# EAGLE design EMGrealPart5-all2 (EAGLE 9.4.0)

## Sheet 1 of 6
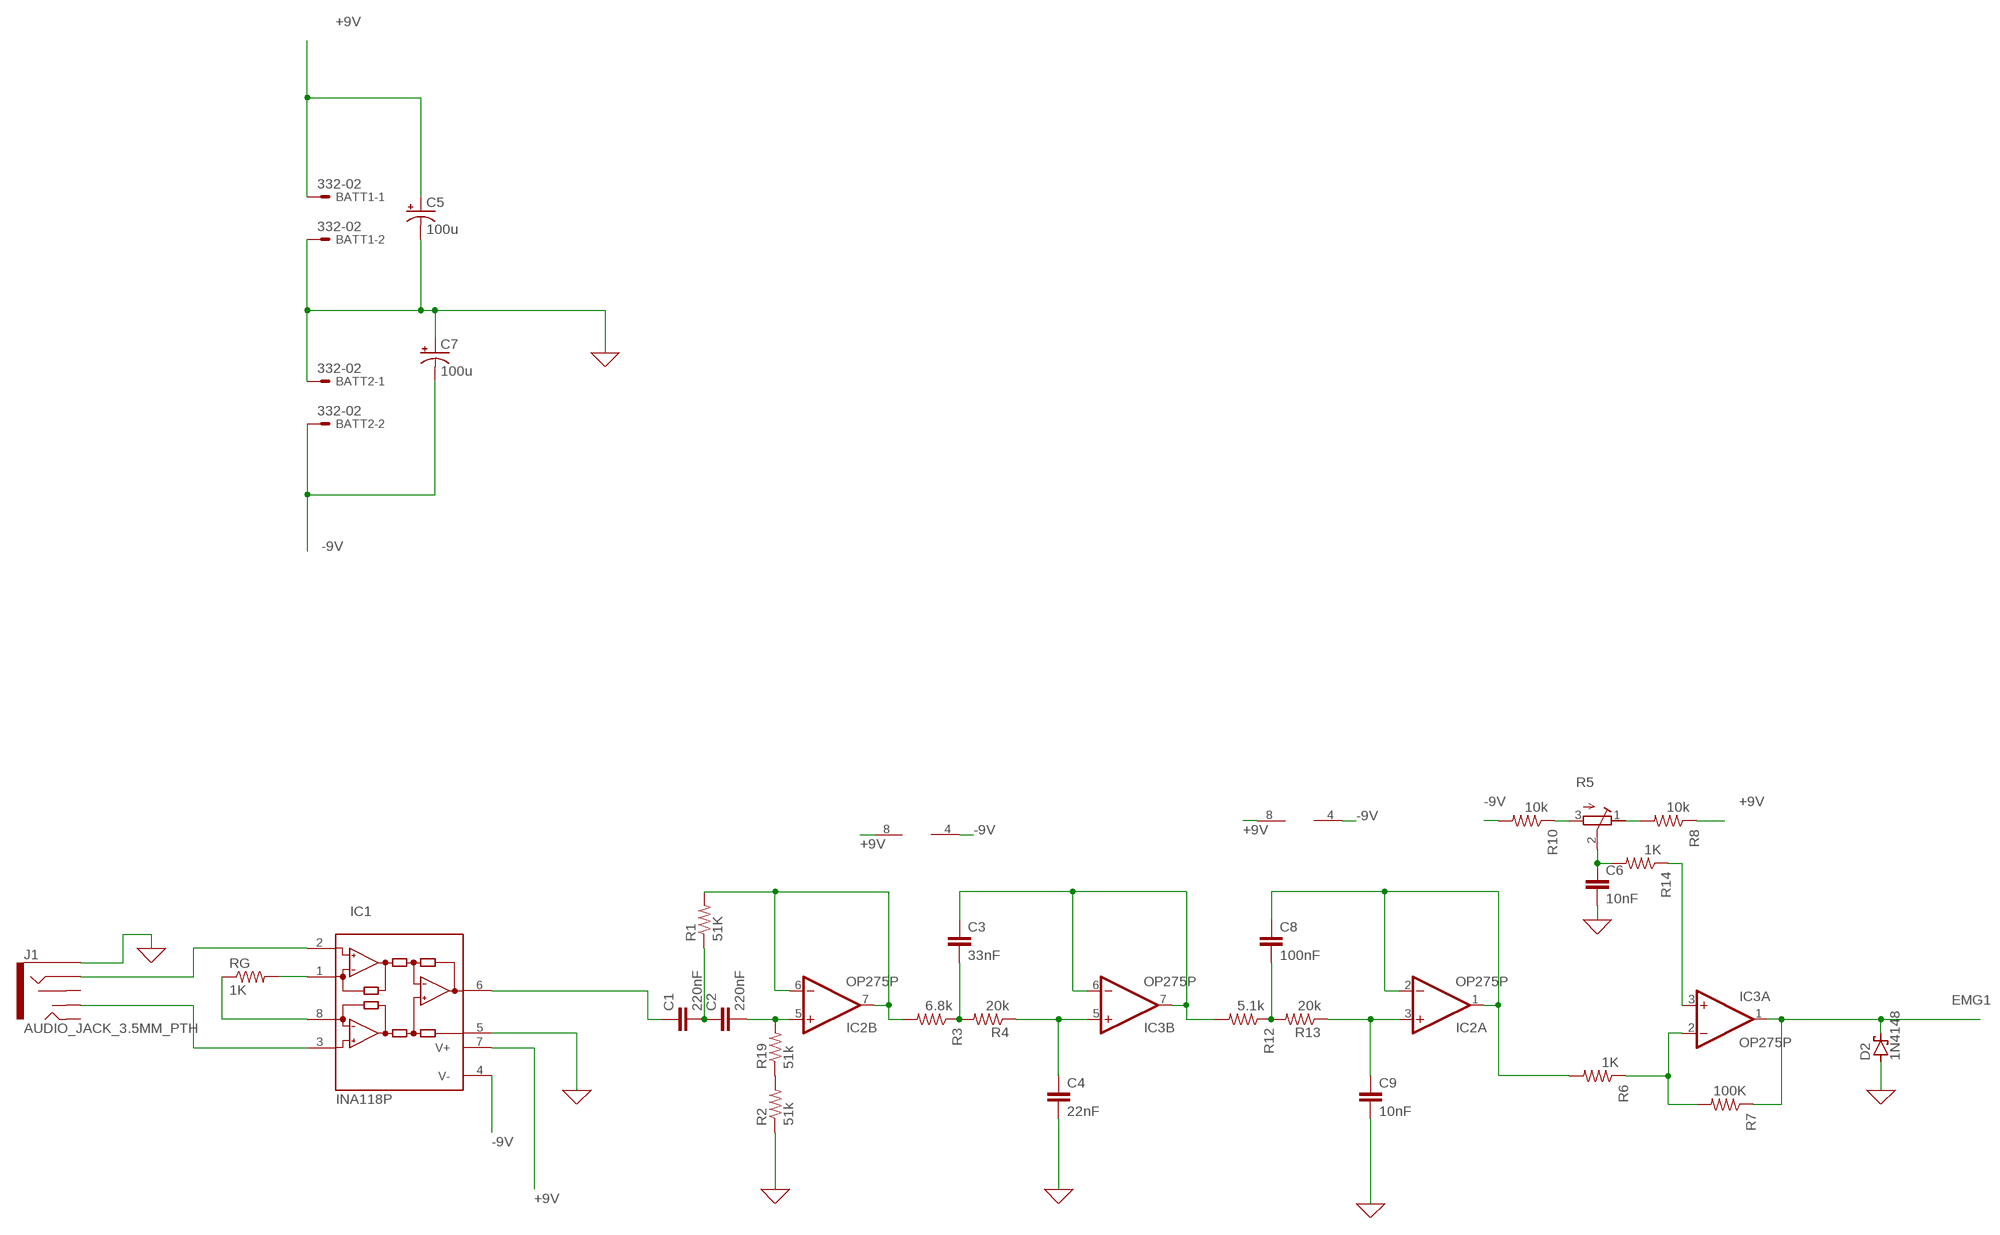
[diagram p0: schematic, sheet 1]

### Parts
BATT1  332-02  [332-02]
BATT2  332-02  [332-02]
C1  220nF  C-EU050-025X075  [C050-025X075]
C2  220nF  C-EU050-025X075  [C050-025X075]
C3  33nF  C-EU050-025X075  [C050-025X075]
C4  22nF  C-EU050-025X075  [C050-025X075]
C5  100u  CPOL-USE2.5-6  [E2,5-6]
C6  10nF  C-EU050-025X075  [C050-025X075]
C7  100u  CPOL-USE2.5-6  [E2,5-6]
C8  100nF  C-EU050-025X075  [C050-025X075]
C9  10nF  C-EU050-025X075  [C050-025X075]
D2  1N4148  SCHOTTKY-DIODEF126Z12  [F126Z12]
IC1  INA118P  [DIL08]
IC2  OP275P  [DIL08]
IC3  OP275P  [DIL08]
J1  AUDIO_JACK_3.5MM_PTH  [AUDIO-JACK]
R1  51K  R-US_0207/12  [0207/12]
R2  51k  R-US_0207/12  [0207/12]
R3  6.8k  R-US_0207/12  [0207/12]
R4  20k  R-US_0207/12  [0207/12]
R5  R-TRIMMT93YA  [RTRIMT93YA]
R6  1K  R-US_0207/12  [0207/12]
R7  100K  R-US_0207/12  [0207/12]
R8  10k  R-US_0207/12  [0207/12]
R10  10k  R-US_0207/12  [0207/12]
R12  5.1k  R-US_0207/12  [0207/12]
R13  20k  R-US_0207/12  [0207/12]
R14  1K  R-US_0207/12  [0207/12]
R19  51k  R-US_0207/12  [0207/12]
RG  1K  R-US_0207/12  [0207/12]

### Nets
0 [supply]: BATT1.2 BATT2.1 C4.2 C5.- C6.2 C7.+ C9.2 D2.A IC1.5(REF) J1.SLEEVE R2.1 ; supply symbol labelled GND ; also sheet 2,3,4,5
+9V [supply]: BATT1.1 C5.+ IC1.7(V+) IC2.8(P:V+) IC3.8(P:V+) R8.1 ; also sheet 2,3,4
-9V [supply]: BATT2.2 C7.- IC1.4(V-) IC2.4(P:V-) IC3.4(P:V-) R10.2 ; also sheet 2,3,4
EMG1 [signal]: D2.C IC3.1(A:OUT) R7.1 ; also sheet 5
N$1 [signal]: IC1.1(RG) RG.2
N$2 [signal]: IC1.8(RG) RG.1
N$3 [signal]: IC1.2(-IN) J1.RING
N$4 [signal]: C8.2 R12.1 R13.2
N$5 [signal]: C1.2 C2.1 R1.1
N$6 [signal]: C1.1 IC1.6(OUT)
N$7 [signal]: C2.2 IC2.5(B:+IN) R19.2
N$8 [signal]: IC2.6(B:-IN) IC2.7(B:OUT) R1.2 R3.2
N$9 [signal]: C3.2 R3.1 R4.2
N$10 [signal]: C4.1 IC3.5(B:+IN) R4.1
N$11 [signal]: C3.1 IC3.6(B:-IN) IC3.7(B:OUT) R12.2
N$14 [signal]: C9.1 IC2.3(A:+IN) R13.1
N$15 [signal]: R5.3(A) R10.1
N$16 [signal]: C6.1 R5.2(S) R14.2
N$17 [signal]: IC3.2(A:-IN) R6.1 R7.2
N$18 [signal]: R2.2 R19.1
N$19 [signal]: C8.1 IC2.1(A:OUT) IC2.2(A:-IN) R6.2
N$20 [signal]: R5.1(E) R8.2
N$25 [signal]: IC3.3(A:+IN) R14.1
N$26 [signal]: IC1.3(+IN) J1.TSH
Unconnected: J1.RSH J1.TIP

## Sheet 2 of 6
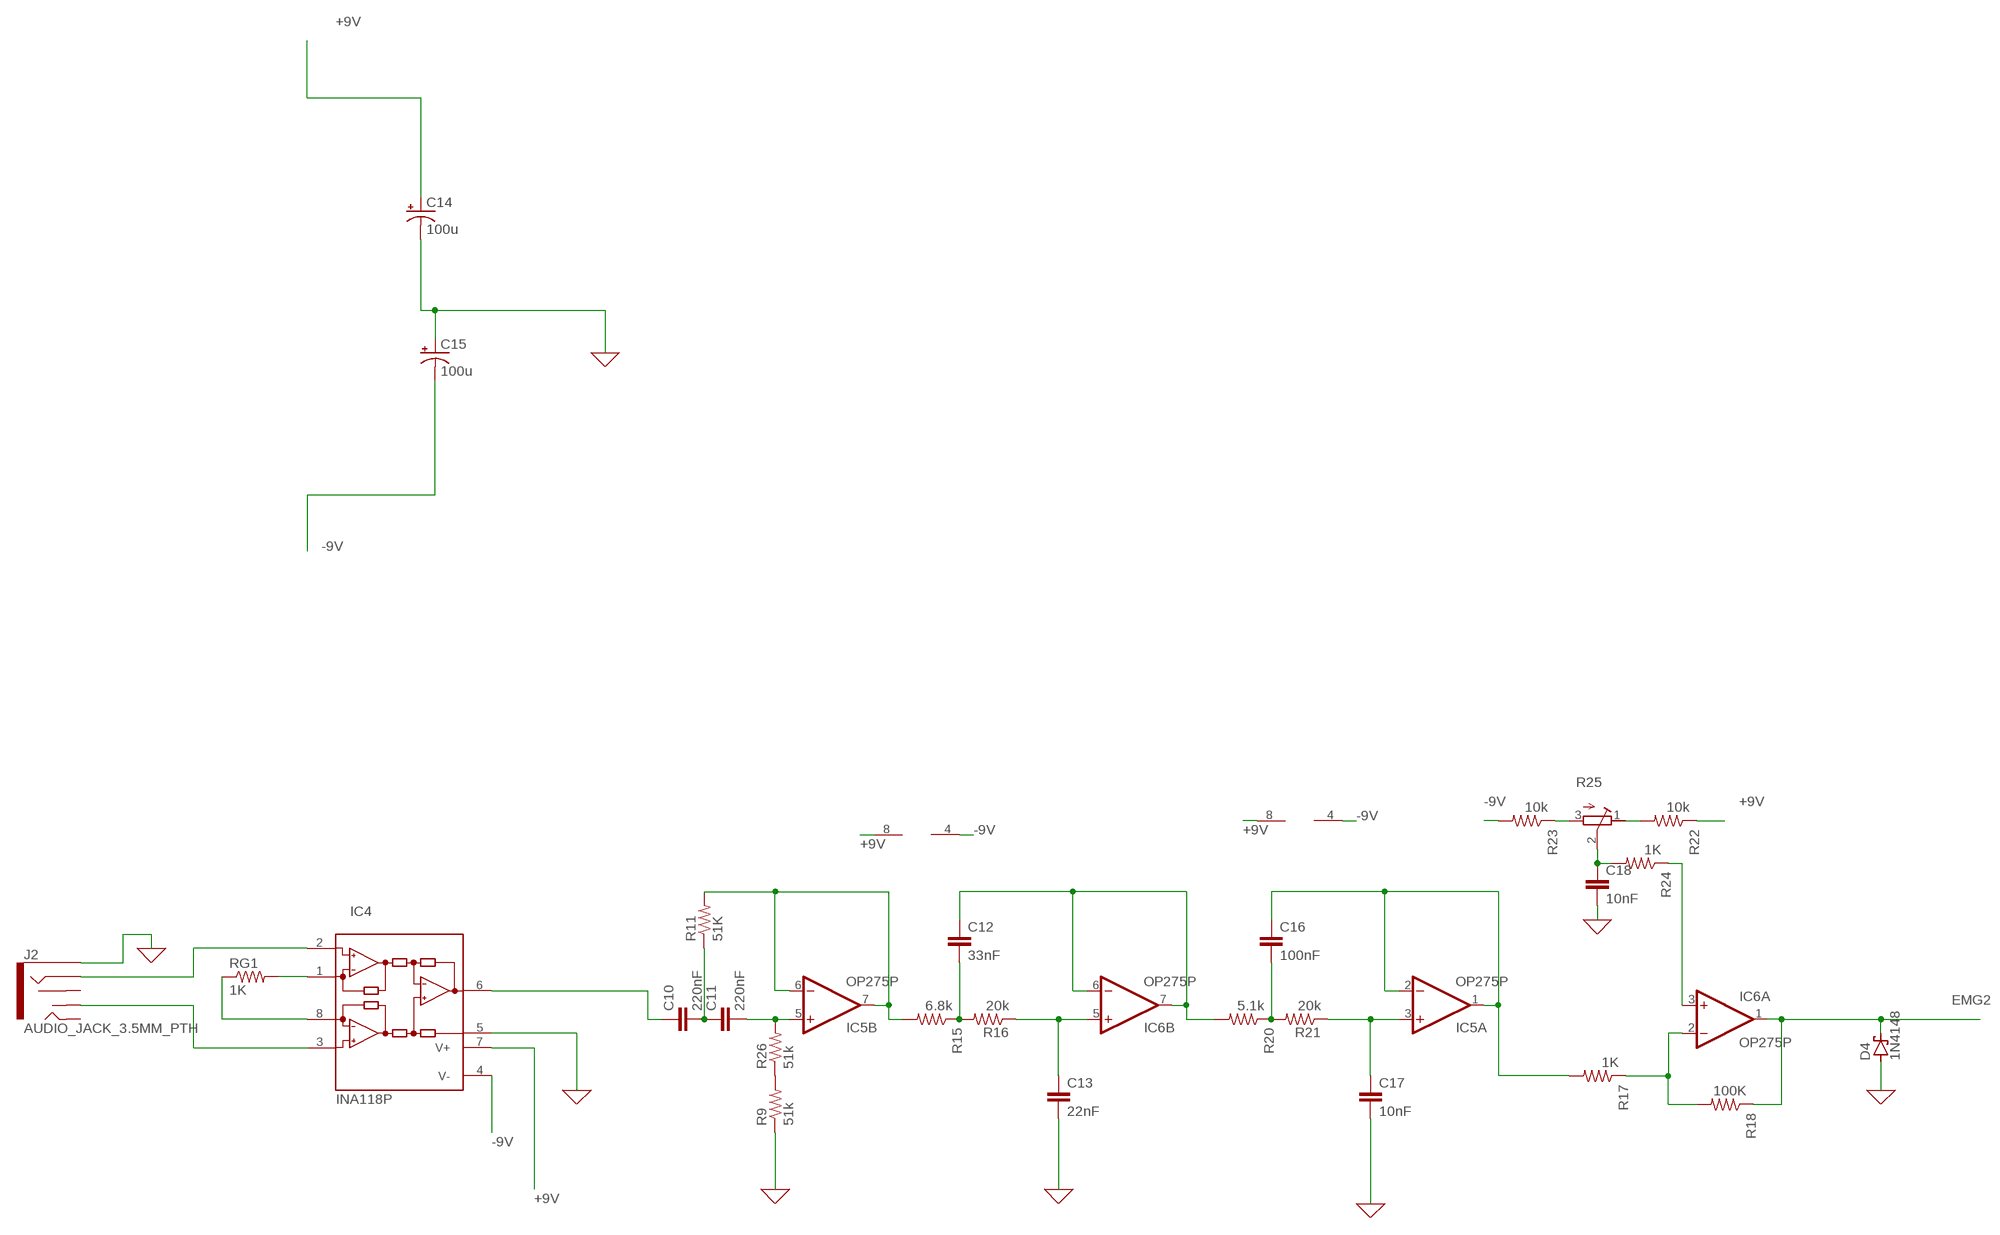
[diagram p1: schematic, sheet 2]

### Parts
C10  220nF  C-EU050-025X075  [C050-025X075]
C11  220nF  C-EU050-025X075  [C050-025X075]
C12  33nF  C-EU050-025X075  [C050-025X075]
C13  22nF  C-EU050-025X075  [C050-025X075]
C14  100u  CPOL-USE2.5-6  [E2,5-6]
C15  100u  CPOL-USE2.5-6  [E2,5-6]
C16  100nF  C-EU050-025X075  [C050-025X075]
C17  10nF  C-EU050-025X075  [C050-025X075]
C18  10nF  C-EU050-025X075  [C050-025X075]
D4  1N4148  SCHOTTKY-DIODEF126Z12  [F126Z12]
IC4  INA118P  [DIL08]
IC5  OP275P  [DIL08]
IC6  OP275P  [DIL08]
J2  AUDIO_JACK_3.5MM_PTH  [AUDIO-JACK]
R9  51k  R-US_0207/12  [0207/12]
R11  51K  R-US_0207/12  [0207/12]
R15  6.8k  R-US_0207/12  [0207/12]
R16  20k  R-US_0207/12  [0207/12]
R17  1K  R-US_0207/12  [0207/12]
R18  100K  R-US_0207/12  [0207/12]
R20  5.1k  R-US_0207/12  [0207/12]
R21  20k  R-US_0207/12  [0207/12]
R22  10k  R-US_0207/12  [0207/12]
R23  10k  R-US_0207/12  [0207/12]
R24  1K  R-US_0207/12  [0207/12]
R25  R-TRIMMT93YA  [RTRIMT93YA]
R26  51k  R-US_0207/12  [0207/12]
RG1  1K  R-US_0207/12  [0207/12]

### Nets
0 [supply]: C13.2 C14.- C15.+ C17.2 C18.2 D4.A IC4.5(REF) J2.SLEEVE R9.1 ; supply symbol labelled GND ; also sheet 1,3,4,5
+9V [supply]: C14.+ IC4.7(V+) IC5.8(P:V+) IC6.8(P:V+) R22.1 ; also sheet 1,3,4
-9V [supply]: C15.- IC4.4(V-) IC5.4(P:V-) IC6.4(P:V-) R23.2 ; also sheet 1,3,4
EMG2 [signal]: D4.C IC6.1(A:OUT) R18.1 ; also sheet 5
N$21 [signal]: IC4.1(RG) RG1.2
N$22 [signal]: IC4.8(RG) RG1.1
N$23 [signal]: C10.1 IC4.6(OUT)
N$24 [signal]: C10.2 C11.1 R11.1
N$27 [signal]: C11.2 IC5.5(B:+IN) R26.2
N$28 [signal]: IC5.6(B:-IN) IC5.7(B:OUT) R11.2 R15.2
N$29 [signal]: C12.2 R15.1 R16.2
N$30 [signal]: C13.1 IC6.5(B:+IN) R16.1
N$31 [signal]: C12.1 IC6.6(B:-IN) IC6.7(B:OUT) R20.2
N$32 [signal]: IC6.2(A:-IN) R17.1 R18.2
N$34 [signal]: C16.2 R20.1 R21.2
N$35 [signal]: C17.1 IC5.3(A:+IN) R21.1
N$36 [signal]: IC4.2(-IN) J2.RING
N$37 [signal]: C16.1 IC5.1(A:OUT) IC5.2(A:-IN) R17.2
N$38 [signal]: IC4.3(+IN) J2.TSH
N$39 [signal]: R23.1 R25.3(A)
N$40 [signal]: R22.2 R25.1(E)
N$41 [signal]: IC6.3(A:+IN) R24.1
N$42 [signal]: C18.1 R24.2 R25.2(S)
N$43 [signal]: R9.2 R26.1
Unconnected: J2.RSH J2.TIP

## Sheet 3 of 6
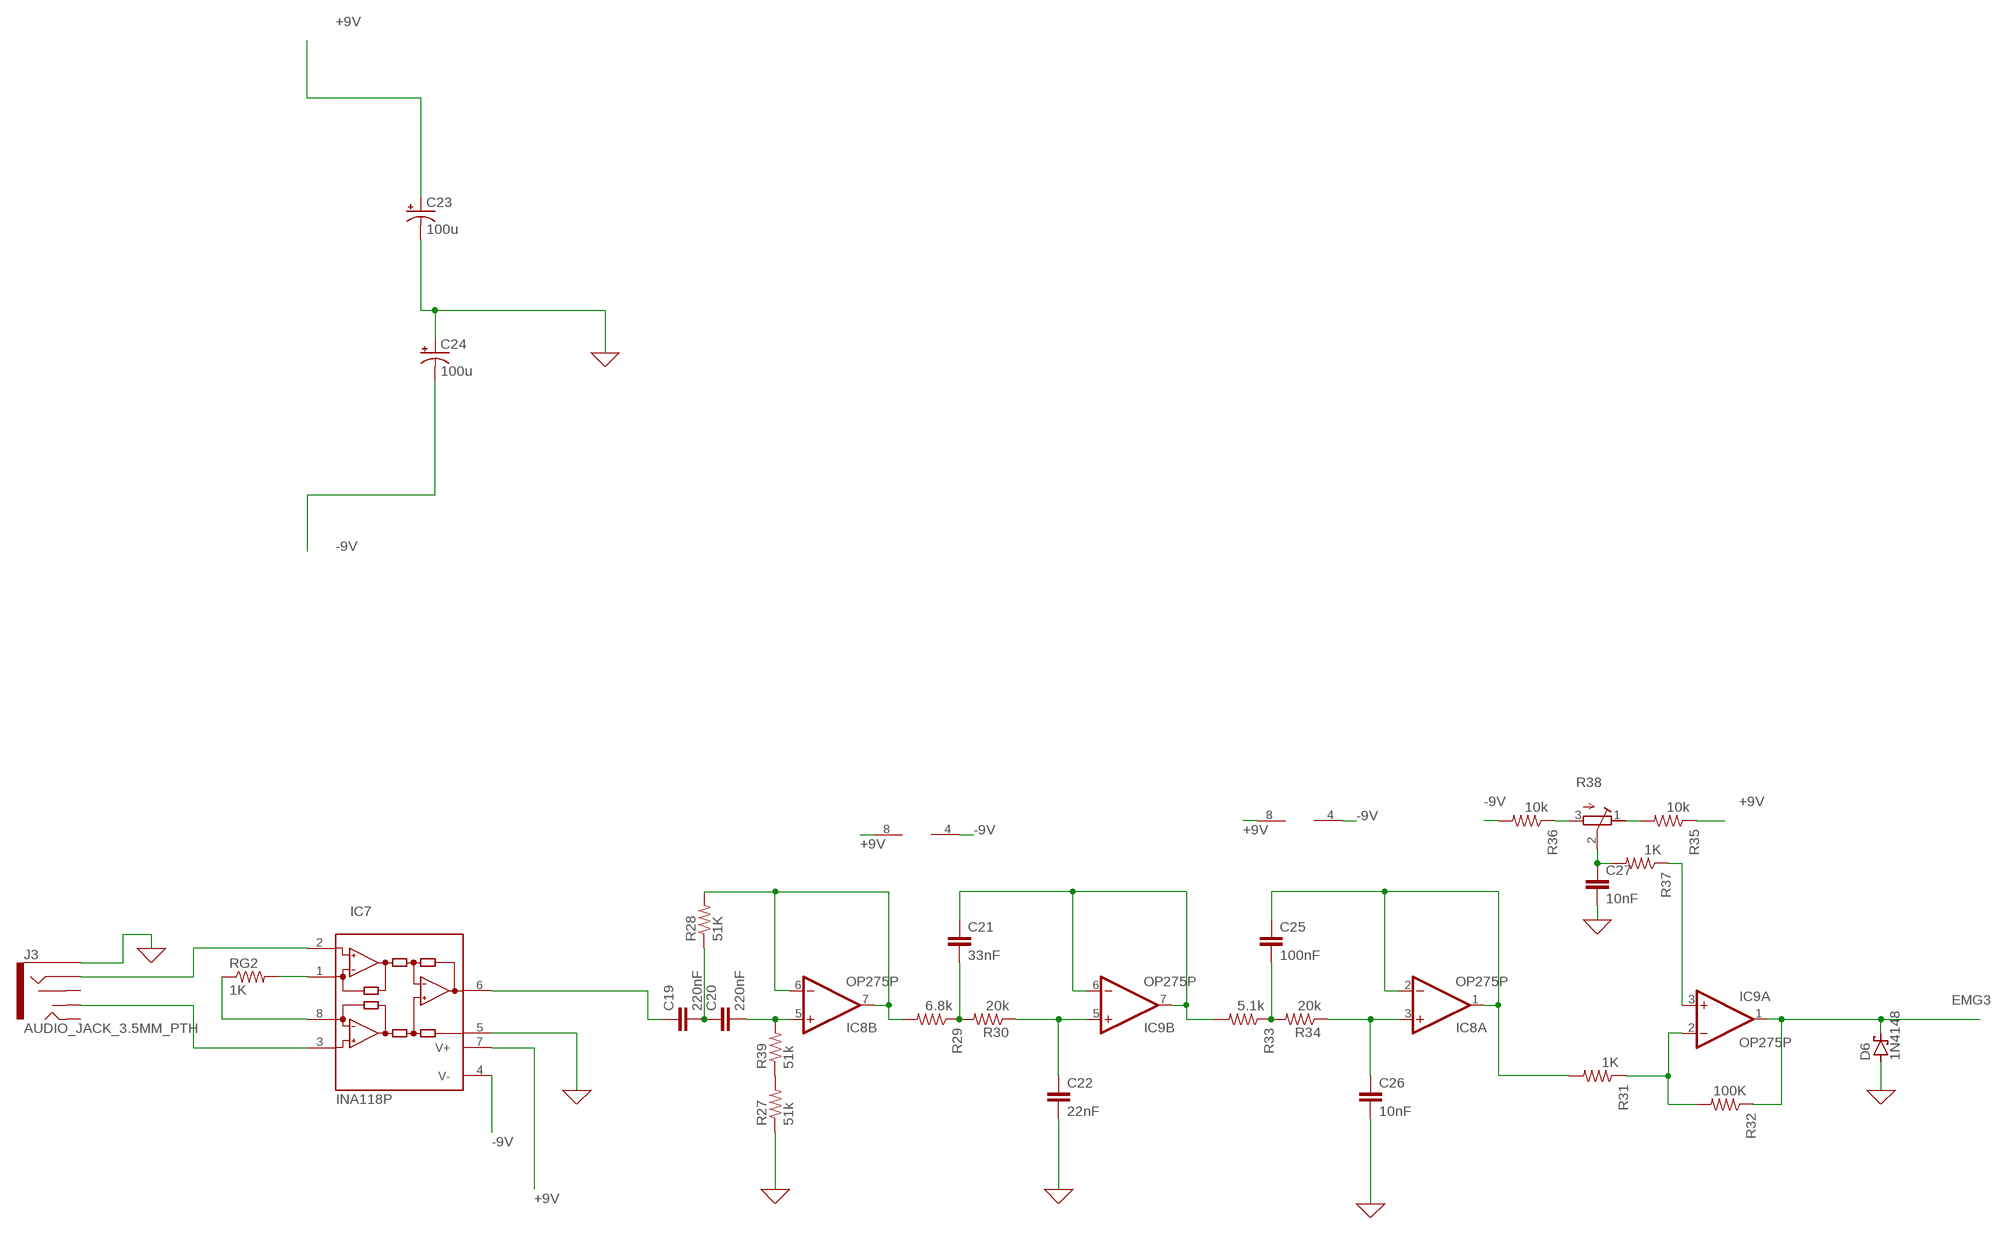
[diagram p2: schematic, sheet 3]

### Parts
C19  220nF  C-EU050-025X075  [C050-025X075]
C20  220nF  C-EU050-025X075  [C050-025X075]
C21  33nF  C-EU050-025X075  [C050-025X075]
C22  22nF  C-EU050-025X075  [C050-025X075]
C23  100u  CPOL-USE2.5-6  [E2,5-6]
C24  100u  CPOL-USE2.5-6  [E2,5-6]
C25  100nF  C-EU050-025X075  [C050-025X075]
C26  10nF  C-EU050-025X075  [C050-025X075]
C27  10nF  C-EU050-025X075  [C050-025X075]
D6  1N4148  SCHOTTKY-DIODEF126Z12  [F126Z12]
IC7  INA118P  [DIL08]
IC8  OP275P  [DIL08]
IC9  OP275P  [DIL08]
J3  AUDIO_JACK_3.5MM_PTH  [AUDIO-JACK]
R27  51k  R-US_0207/12  [0207/12]
R28  51K  R-US_0207/12  [0207/12]
R29  6.8k  R-US_0207/12  [0207/12]
R30  20k  R-US_0207/12  [0207/12]
R31  1K  R-US_0207/12  [0207/12]
R32  100K  R-US_0207/12  [0207/12]
R33  5.1k  R-US_0207/12  [0207/12]
R34  20k  R-US_0207/12  [0207/12]
R35  10k  R-US_0207/12  [0207/12]
R36  10k  R-US_0207/12  [0207/12]
R37  1K  R-US_0207/12  [0207/12]
R38  R-TRIMMT93YA  [RTRIMT93YA]
R39  51k  R-US_0207/12  [0207/12]
RG2  1K  R-US_0207/12  [0207/12]

### Nets
0 [supply]: C22.2 C23.- C24.+ C26.2 C27.2 D6.A IC7.5(REF) J3.SLEEVE R27.1 ; supply symbol labelled GND ; also sheet 1,2,4,5
+9V [supply]: C23.+ IC7.7(V+) IC8.8(P:V+) IC9.8(P:V+) R35.1 ; also sheet 1,2,4
-9V [supply]: C24.- IC7.4(V-) IC8.4(P:V-) IC9.4(P:V-) R36.2 ; also sheet 1,2,4
EMG3 [signal]: D6.C IC9.1(A:OUT) R32.1 ; also sheet 5
N$44 [signal]: IC7.1(RG) RG2.2
N$45 [signal]: IC7.8(RG) RG2.1
N$46 [signal]: C19.1 IC7.6(OUT)
N$47 [signal]: C19.2 C20.1 R28.1
N$48 [signal]: C20.2 IC8.5(B:+IN) R39.2
N$49 [signal]: IC8.6(B:-IN) IC8.7(B:OUT) R28.2 R29.2
N$50 [signal]: C21.2 R29.1 R30.2
N$51 [signal]: C22.1 IC9.5(B:+IN) R30.1
N$52 [signal]: C21.1 IC9.6(B:-IN) IC9.7(B:OUT) R33.2
N$53 [signal]: IC9.2(A:-IN) R31.1 R32.2
N$55 [signal]: C25.2 R33.1 R34.2
N$56 [signal]: C26.1 IC8.3(A:+IN) R34.1
N$57 [signal]: IC7.2(-IN) J3.RING
N$58 [signal]: C25.1 IC8.1(A:OUT) IC8.2(A:-IN) R31.2
N$59 [signal]: IC7.3(+IN) J3.TSH
N$60 [signal]: R36.1 R38.3(A)
N$61 [signal]: R35.2 R38.1(E)
N$62 [signal]: IC9.3(A:+IN) R37.1
N$63 [signal]: C27.1 R37.2 R38.2(S)
N$64 [signal]: R27.2 R39.1
Unconnected: J3.RSH J3.TIP

## Sheet 4 of 6
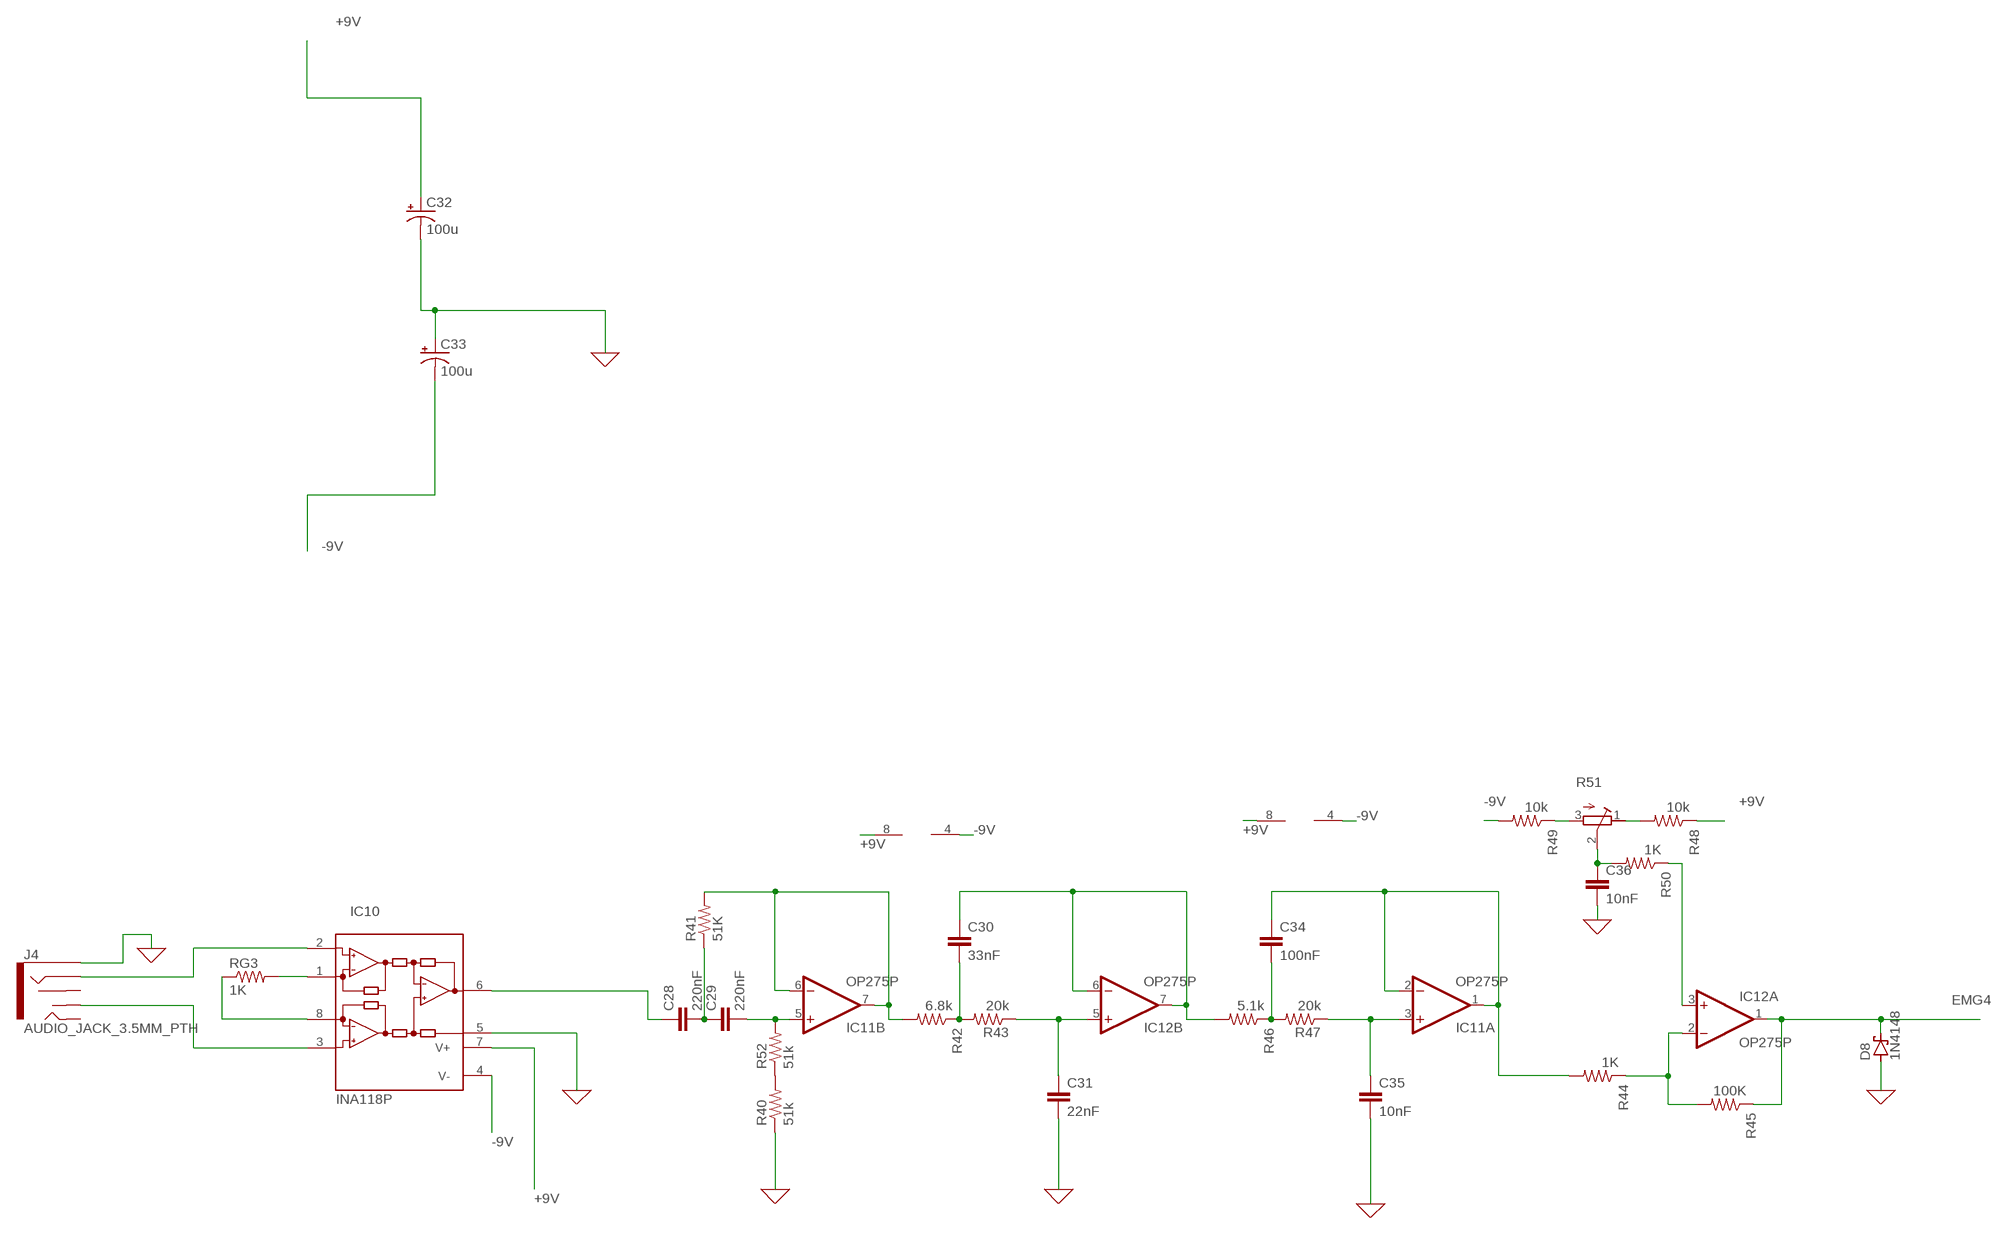
[diagram p3: schematic, sheet 4]

### Parts
C28  220nF  C-EU050-025X075  [C050-025X075]
C29  220nF  C-EU050-025X075  [C050-025X075]
C30  33nF  C-EU050-025X075  [C050-025X075]
C31  22nF  C-EU050-025X075  [C050-025X075]
C32  100u  CPOL-USE2.5-6  [E2,5-6]
C33  100u  CPOL-USE2.5-6  [E2,5-6]
C34  100nF  C-EU050-025X075  [C050-025X075]
C35  10nF  C-EU050-025X075  [C050-025X075]
C36  10nF  C-EU050-025X075  [C050-025X075]
D8  1N4148  SCHOTTKY-DIODEF126Z12  [F126Z12]
IC10  INA118P  [DIL08]
IC11  OP275P  [DIL08]
IC12  OP275P  [DIL08]
J4  AUDIO_JACK_3.5MM_PTH  [AUDIO-JACK]
R40  51k  R-US_0207/12  [0207/12]
R41  51K  R-US_0207/12  [0207/12]
R42  6.8k  R-US_0207/12  [0207/12]
R43  20k  R-US_0207/12  [0207/12]
R44  1K  R-US_0207/12  [0207/12]
R45  100K  R-US_0207/12  [0207/12]
R46  5.1k  R-US_0207/12  [0207/12]
R47  20k  R-US_0207/12  [0207/12]
R48  10k  R-US_0207/12  [0207/12]
R49  10k  R-US_0207/12  [0207/12]
R50  1K  R-US_0207/12  [0207/12]
R51  R-TRIMMT93YA  [RTRIMT93YA]
R52  51k  R-US_0207/12  [0207/12]
RG3  1K  R-US_0207/12  [0207/12]

### Nets
0 [supply]: C31.2 C32.- C33.+ C35.2 C36.2 D8.A IC10.5(REF) J4.SLEEVE R40.1 ; supply symbol labelled GND ; also sheet 1,2,3,5
+9V [supply]: C32.+ IC10.7(V+) IC11.8(P:V+) IC12.8(P:V+) R48.1 ; also sheet 1,2,3
-9V [supply]: C33.- IC10.4(V-) IC11.4(P:V-) IC12.4(P:V-) R49.2 ; also sheet 1,2,3
EMG4 [signal]: D8.C IC12.1(A:OUT) R45.1 ; also sheet 5
N$65 [signal]: IC10.1(RG) RG3.2
N$66 [signal]: IC10.8(RG) RG3.1
N$67 [signal]: C28.1 IC10.6(OUT)
N$68 [signal]: C28.2 C29.1 R41.1
N$69 [signal]: C29.2 IC11.5(B:+IN) R52.2
N$70 [signal]: IC11.6(B:-IN) IC11.7(B:OUT) R41.2 R42.2
N$71 [signal]: C30.2 R42.1 R43.2
N$72 [signal]: C31.1 IC12.5(B:+IN) R43.1
N$73 [signal]: C30.1 IC12.6(B:-IN) IC12.7(B:OUT) R46.2
N$74 [signal]: IC12.2(A:-IN) R44.1 R45.2
N$76 [signal]: C34.2 R46.1 R47.2
N$77 [signal]: C35.1 IC11.3(A:+IN) R47.1
N$78 [signal]: IC10.2(-IN) J4.RING
N$79 [signal]: C34.1 IC11.1(A:OUT) IC11.2(A:-IN) R44.2
N$80 [signal]: IC10.3(+IN) J4.TSH
N$81 [signal]: R49.1 R51.3(A)
N$82 [signal]: R48.2 R51.1(E)
N$83 [signal]: IC12.3(A:+IN) R50.1
N$84 [signal]: C36.1 R50.2 R51.2(S)
N$85 [signal]: R40.2 R52.1
Unconnected: J4.RSH J4.TIP

## Sheet 5 of 6
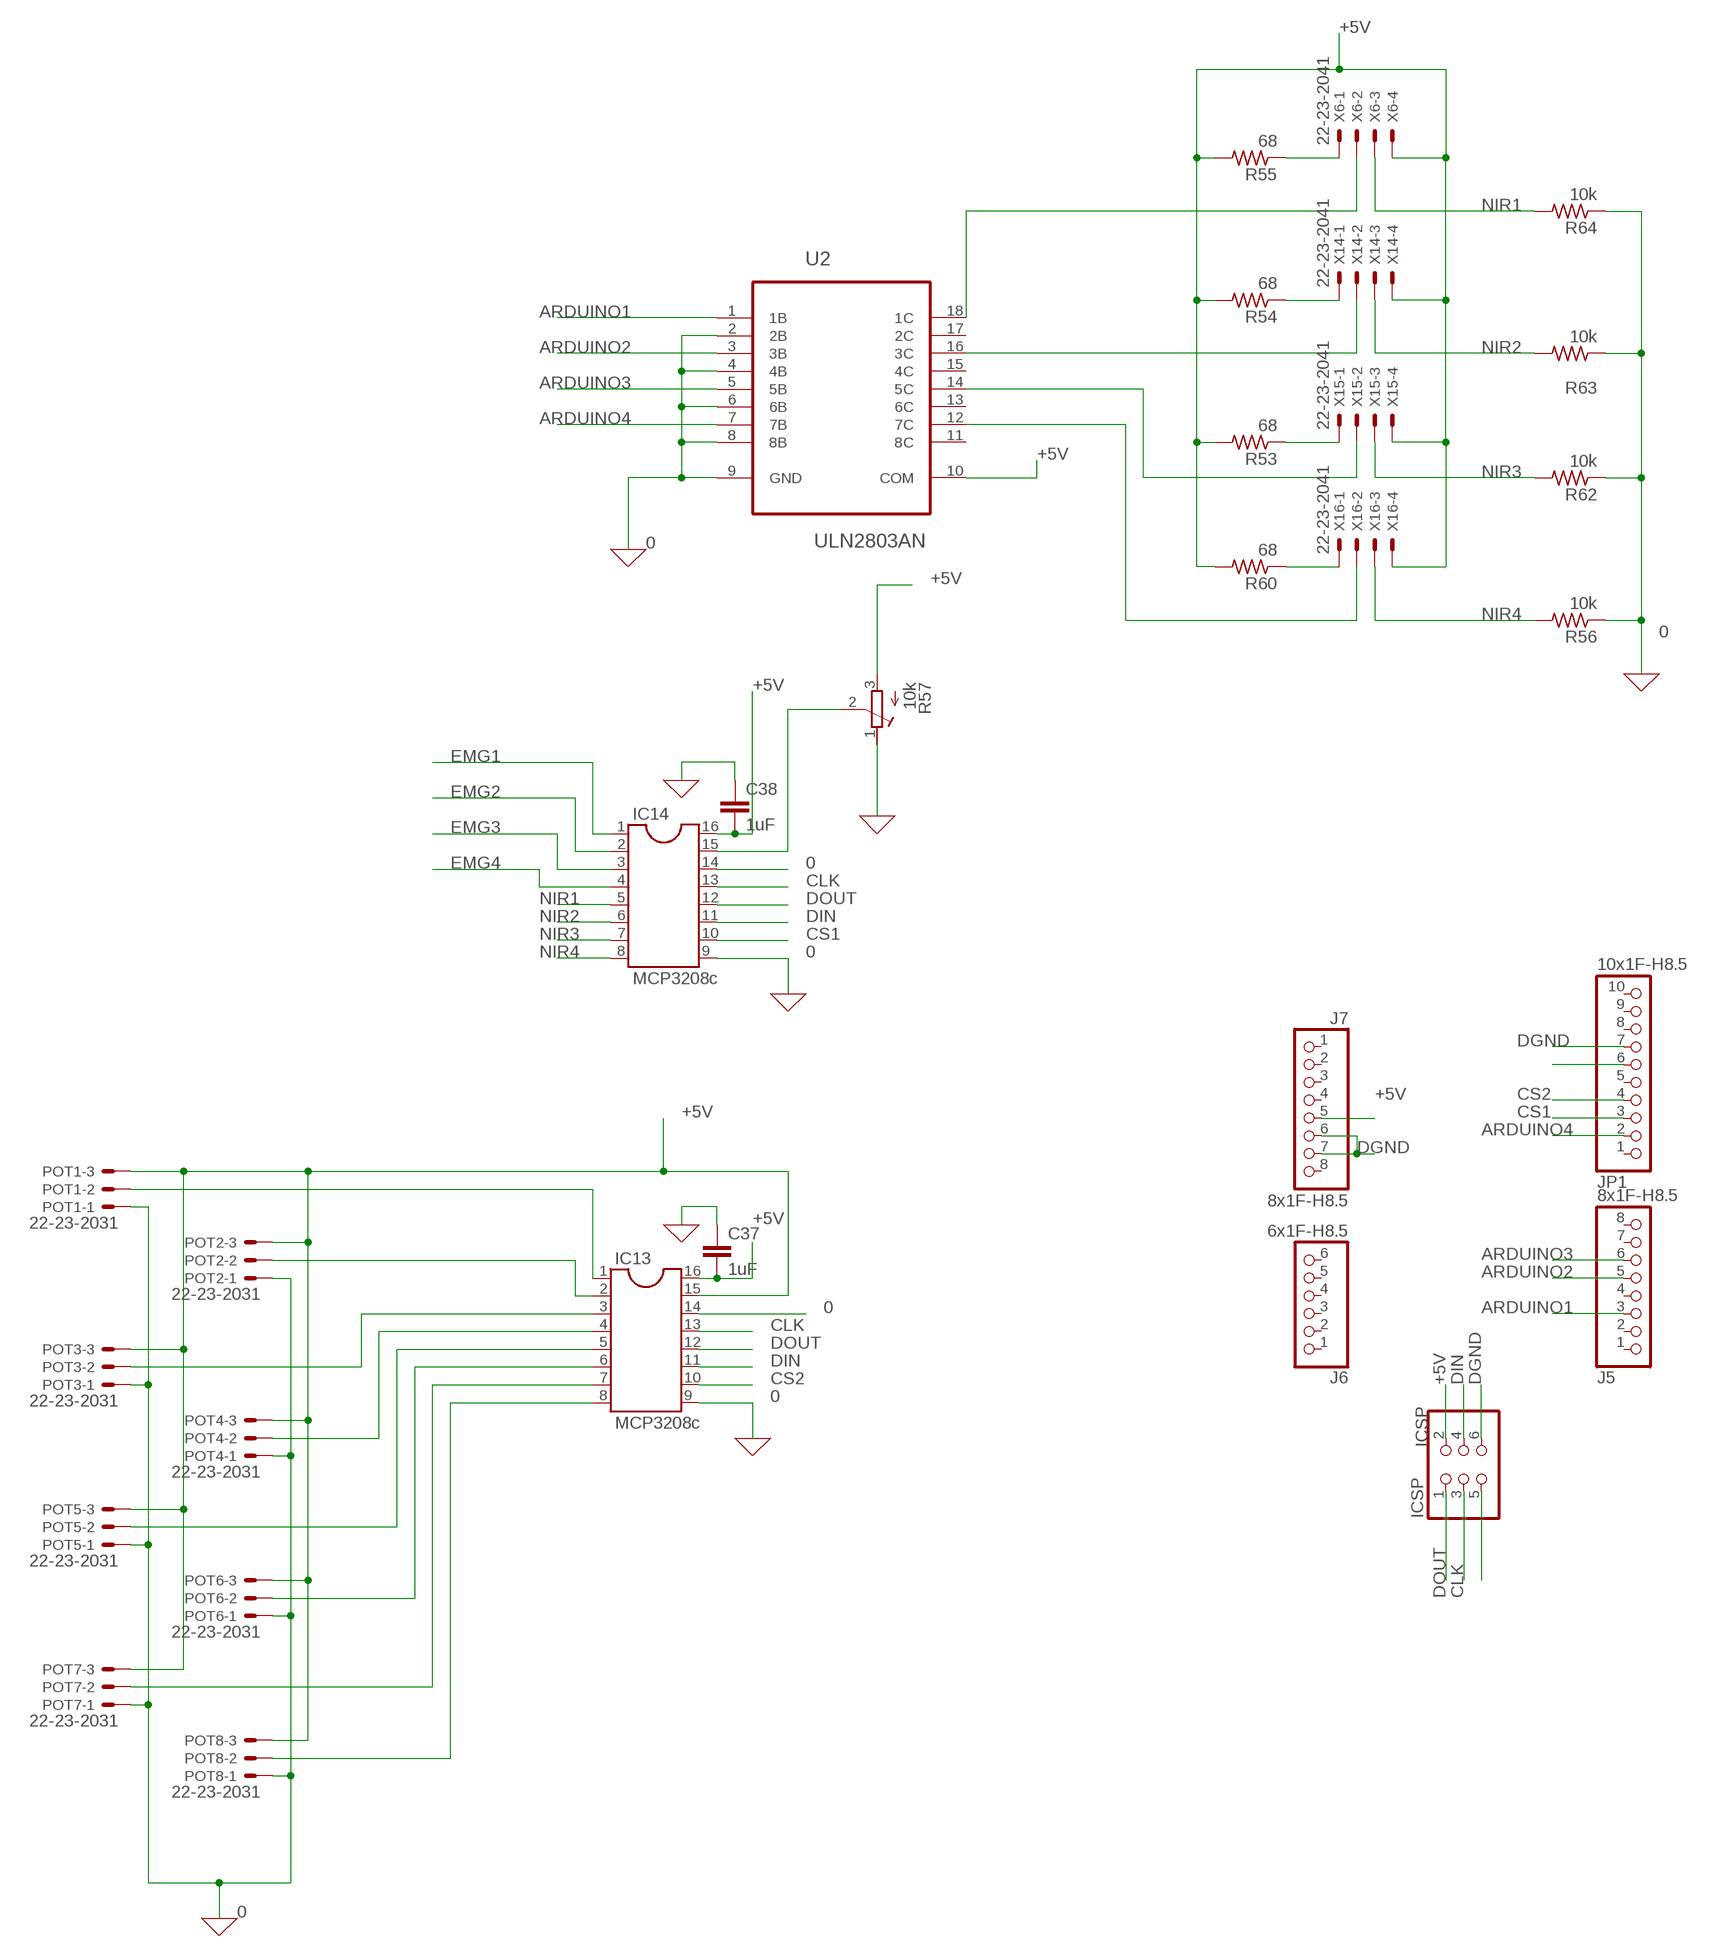
[diagram p4: schematic, sheet 5]

### Parts
C37  1uF  C-EU050-025X075  [C050-025X075]
C38  1uF  C-EU050-025X075  [C050-025X075]
IC13  MCP3208c  DIL16  [DIL16]
IC14  MCP3208c  DIL16  [DIL16]
ICSP  ICSP  PINHD-2X3  [2X03]
J5  8x1F-H8.5  PINHD-1X8  [1X08]
J6  6x1F-H8.5  PINHD-1X6  [1X06]
J7  8x1F-H8.5  PINHD-1X8  [1X08]
JP1  10x1F-H8.5  PINHD-1X10  [1X10]
POT1  22-23-2031  [22-23-2031]
POT2  22-23-2031  [22-23-2031]
POT3  22-23-2031  [22-23-2031]
POT4  22-23-2031  [22-23-2031]
POT5  22-23-2031  [22-23-2031]
POT6  22-23-2031  [22-23-2031]
POT7  22-23-2031  [22-23-2031]
POT8  22-23-2031  [22-23-2031]
R53  68  R-US_0207/12  [0207/12]
R54  68  R-US_0207/12  [0207/12]
R55  68  R-US_0207/12  [0207/12]
R56  10k  R-US_0207/12  [0207/12]
R57  10k  R-TRIMMT93YA  [RTRIMT93YA]
R60  68  R-US_0207/12  [0207/12]
R62  10k  R-US_0207/12  [0207/12]
R63  10k  R-US_0207/12  [0207/12]
R64  10k  R-US_0207/12  [0207/12]
U2  ULN2803AN  [DIP254P762X393-18]
X6  22-23-2041  [22-23-2041]
X14  22-23-2041  [22-23-2041]
X15  22-23-2041  [22-23-2041]
X16  22-23-2041  [22-23-2041]

### Nets
0 [supply]: C37.1 C38.1 IC13.9 IC13.14 IC14.9 IC14.14 POT1.1 POT2.1 POT3.1 POT4.1 POT5.1 POT6.1 POT7.1 POT8.1 R56.1 R57.1(E) R62.1 R63.1 R64.1 U2.2(2B) U2.4(4B) U2.6(6B) U2.8(8B) U2.9(GND) ; supply symbol labelled GND ; also sheet 1,2,3,4
+5V [supply]: C37.2 C38.2 IC13.15 IC13.16 IC14.16 ICSP.2 J7.5 POT1.3 POT2.3 POT3.3 POT4.3 POT5.3 POT6.3 POT7.3 POT8.3 R53.2 R54.2 R55.2 R57.3(A) R60.2 U2.10(COM) X6.4 X14.4 X15.4 X16.4
ARDUINO1 [signal]: J5.3 U2.1(1B)
ARDUINO2 [signal]: J5.5 U2.3(3B)
ARDUINO3 [signal]: J5.6 U2.5(5B)
ARDUINO4 [signal]: JP1.2 U2.7(7B)
CLK [signal]: IC13.13 IC14.13 ICSP.3
CS1 [signal]: IC14.10 JP1.3
CS2 [signal]: IC13.10 JP1.4
DGND [supply]: ICSP.6 J7.6 J7.7 JP1.7
DIN [signal]: IC13.11 IC14.11 ICSP.4
DOUT [signal]: IC13.12 IC14.12 ICSP.1
EMG1 [signal]: IC14.1 ; also sheet 1
EMG2 [signal]: IC14.2 ; also sheet 2
EMG3 [signal]: IC14.3 ; also sheet 3
EMG4 [signal]: IC14.4 ; also sheet 4
N$12 [signal]: U2.18(1C) X6.2
N$86 [signal]: U2.16(3C) X14.2
N$87 [signal]: U2.14(5C) X15.2
N$88 [signal]: U2.12(7C) X16.2
N$89 [signal]: IC13.1 POT1.2
N$90 [signal]: IC13.2 POT2.2
N$91 [signal]: IC13.3 POT3.2
N$92 [signal]: IC13.4 POT4.2
N$93 [signal]: IC13.5 POT5.2
N$94 [signal]: IC13.6 POT6.2
N$95 [signal]: IC13.7 POT7.2
N$96 [signal]: IC13.8 POT8.2
N$97 [signal]: IC14.15 R57.2(S)
N$98 [signal]: R55.1 X6.1
N$99 [signal]: R54.1 X14.1
N$100 [signal]: R53.1 X15.1
N$101 [signal]: R60.1 X16.1
N$102: ICSP.5
N$103: JP1.6
NIR1 [signal]: IC14.5 R64.2 X6.3
NIR2 [signal]: IC14.6 R63.2 X14.3
NIR3 [signal]: IC14.7 R62.2 X15.3
NIR4 [signal]: IC14.8 R56.2 X16.3
Unconnected: J5.1 J5.2 J5.4 J5.7 J5.8 J6.1 J6.2 J6.3 J6.4 J6.5 J6.6 J7.1 J7.2 J7.3 J7.4 J7.8 JP1.1 JP1.5 JP1.8 JP1.9 JP1.10 U2.11(8C) U2.13(6C) U2.15(4C) U2.17(2C)

## Sheet 6 of 6

## Library data of the parts
BATT1 BATT2 = con-garry:332-02: 2 Pin - 2mm Dual Row Source: www.mpe-connector.de / garry_shortform_2012.pdf
C1-C4 C6 C8-C13 C16-C22 C25-C31 C34-C38 = rcl:C-EU: CAPACITOR, European symbol; SPICEPREFIX: C
C5 C7 C14 C15 C23 C24 C32 C33 = rcl:CPOL-US: POLARIZED CAPACITOR, American symbol; SPICEPREFIX: C
D2 D4 D6 D8 = diode:SCHOTTKY-DIODE: Schottky Diode
IC1 IC4 IC7 IC10 = burr-brown:INA118: Instrumentation Amplifier Precision, Low Power; MF: TEXAS INSTRUMENTS; MPN: INA118P; OC_FARNELL: 1470354; OC_NEWARK: 96K4515; SPICEMODEL: INA118a; SPICEPREFIX: X
IC2 IC3 IC5 IC6 IC8 IC9 IC11 IC12 = linear:OP275: Dual Very Low Noise Precision Operational Amplifier Source: http://www.analog.com/static/imported-files/data_sheets/OP270.pdf; SPICEMODEL: OP275p; SPICEPREFIX: X
IC13 IC14 = ic-package:DIL16: Dual In Line / Socket
ICSP = SmartPrj:PINHD-2X3: PIN HEADER
J1-J4 = SparkFun-Connectors:AUDIO_JACK_3.5MM: Audio Jack 3.5mm variants of PTH and SMT stereo audio jack with bypass switches. SparkFun Products: SparkFun SparkPunk Sound Kit <[https://www.sparkfun.com/products/11177]> - PTH MP3 Trigger <https://www.sparkfun.com/products/13720> -3.5mm SMD SparkFun PicoBoard <https://www.sparkfun.com/products/11888>- 2.5mm SMD; PROD_ID: CONN-08774; SF_ID: PRT-08032
J5 J7 = SmartPrj:PINHD-1X8: PIN HEADER
J6 = SmartPrj:PINHD-1X6: PIN HEADER
JP1 = SmartPrj:PINHD-1X10: PIN HEADER
POT1-POT8 = con-molex:22-23-2031: .100" (2.54mm) Center Header - 3 Pin; MF: MOLEX; MPN: 22-23-2031; OC_FARNELL: 1462950; OC_NEWARK: 30C0862
R1-R4 R6-R24 R26-R37 R39-R50 R52-R56 R60 R62-R64 RG RG1-RG3 = rcl:R-US_: RESISTOR, American symbol; SPICEPREFIX: R
R5 R25 R38 R51 R57 = rcl:R-TRIMM: Trimm resistor; SPICEMODEL: X; SPICEPREFIXL: POT
U2 = transistor-arrays:ULN2803AN: Darlington transistor array; MPN: ULN2803AN; OC_FARNELL: 1652422; OC_NEWARK: 21J9298; PACKAGE: DIP-18; SUPPLIER: TEXAS INSTRUMENTS
X6 X14-X16 = con-molex:22-23-2041: .100" (2.54mm) Center Header - 4 Pin; MF: MOLEX; MPN: 22-23-2041; OC_FARNELL: 1462920; OC_NEWARK: 38C0355

## Module MO
Ports: OUT(io) IN(io)

### Library data of the parts

## Net classes
1 signal: width 0.305 mm
2 supply: width 0.635 mm

## Board
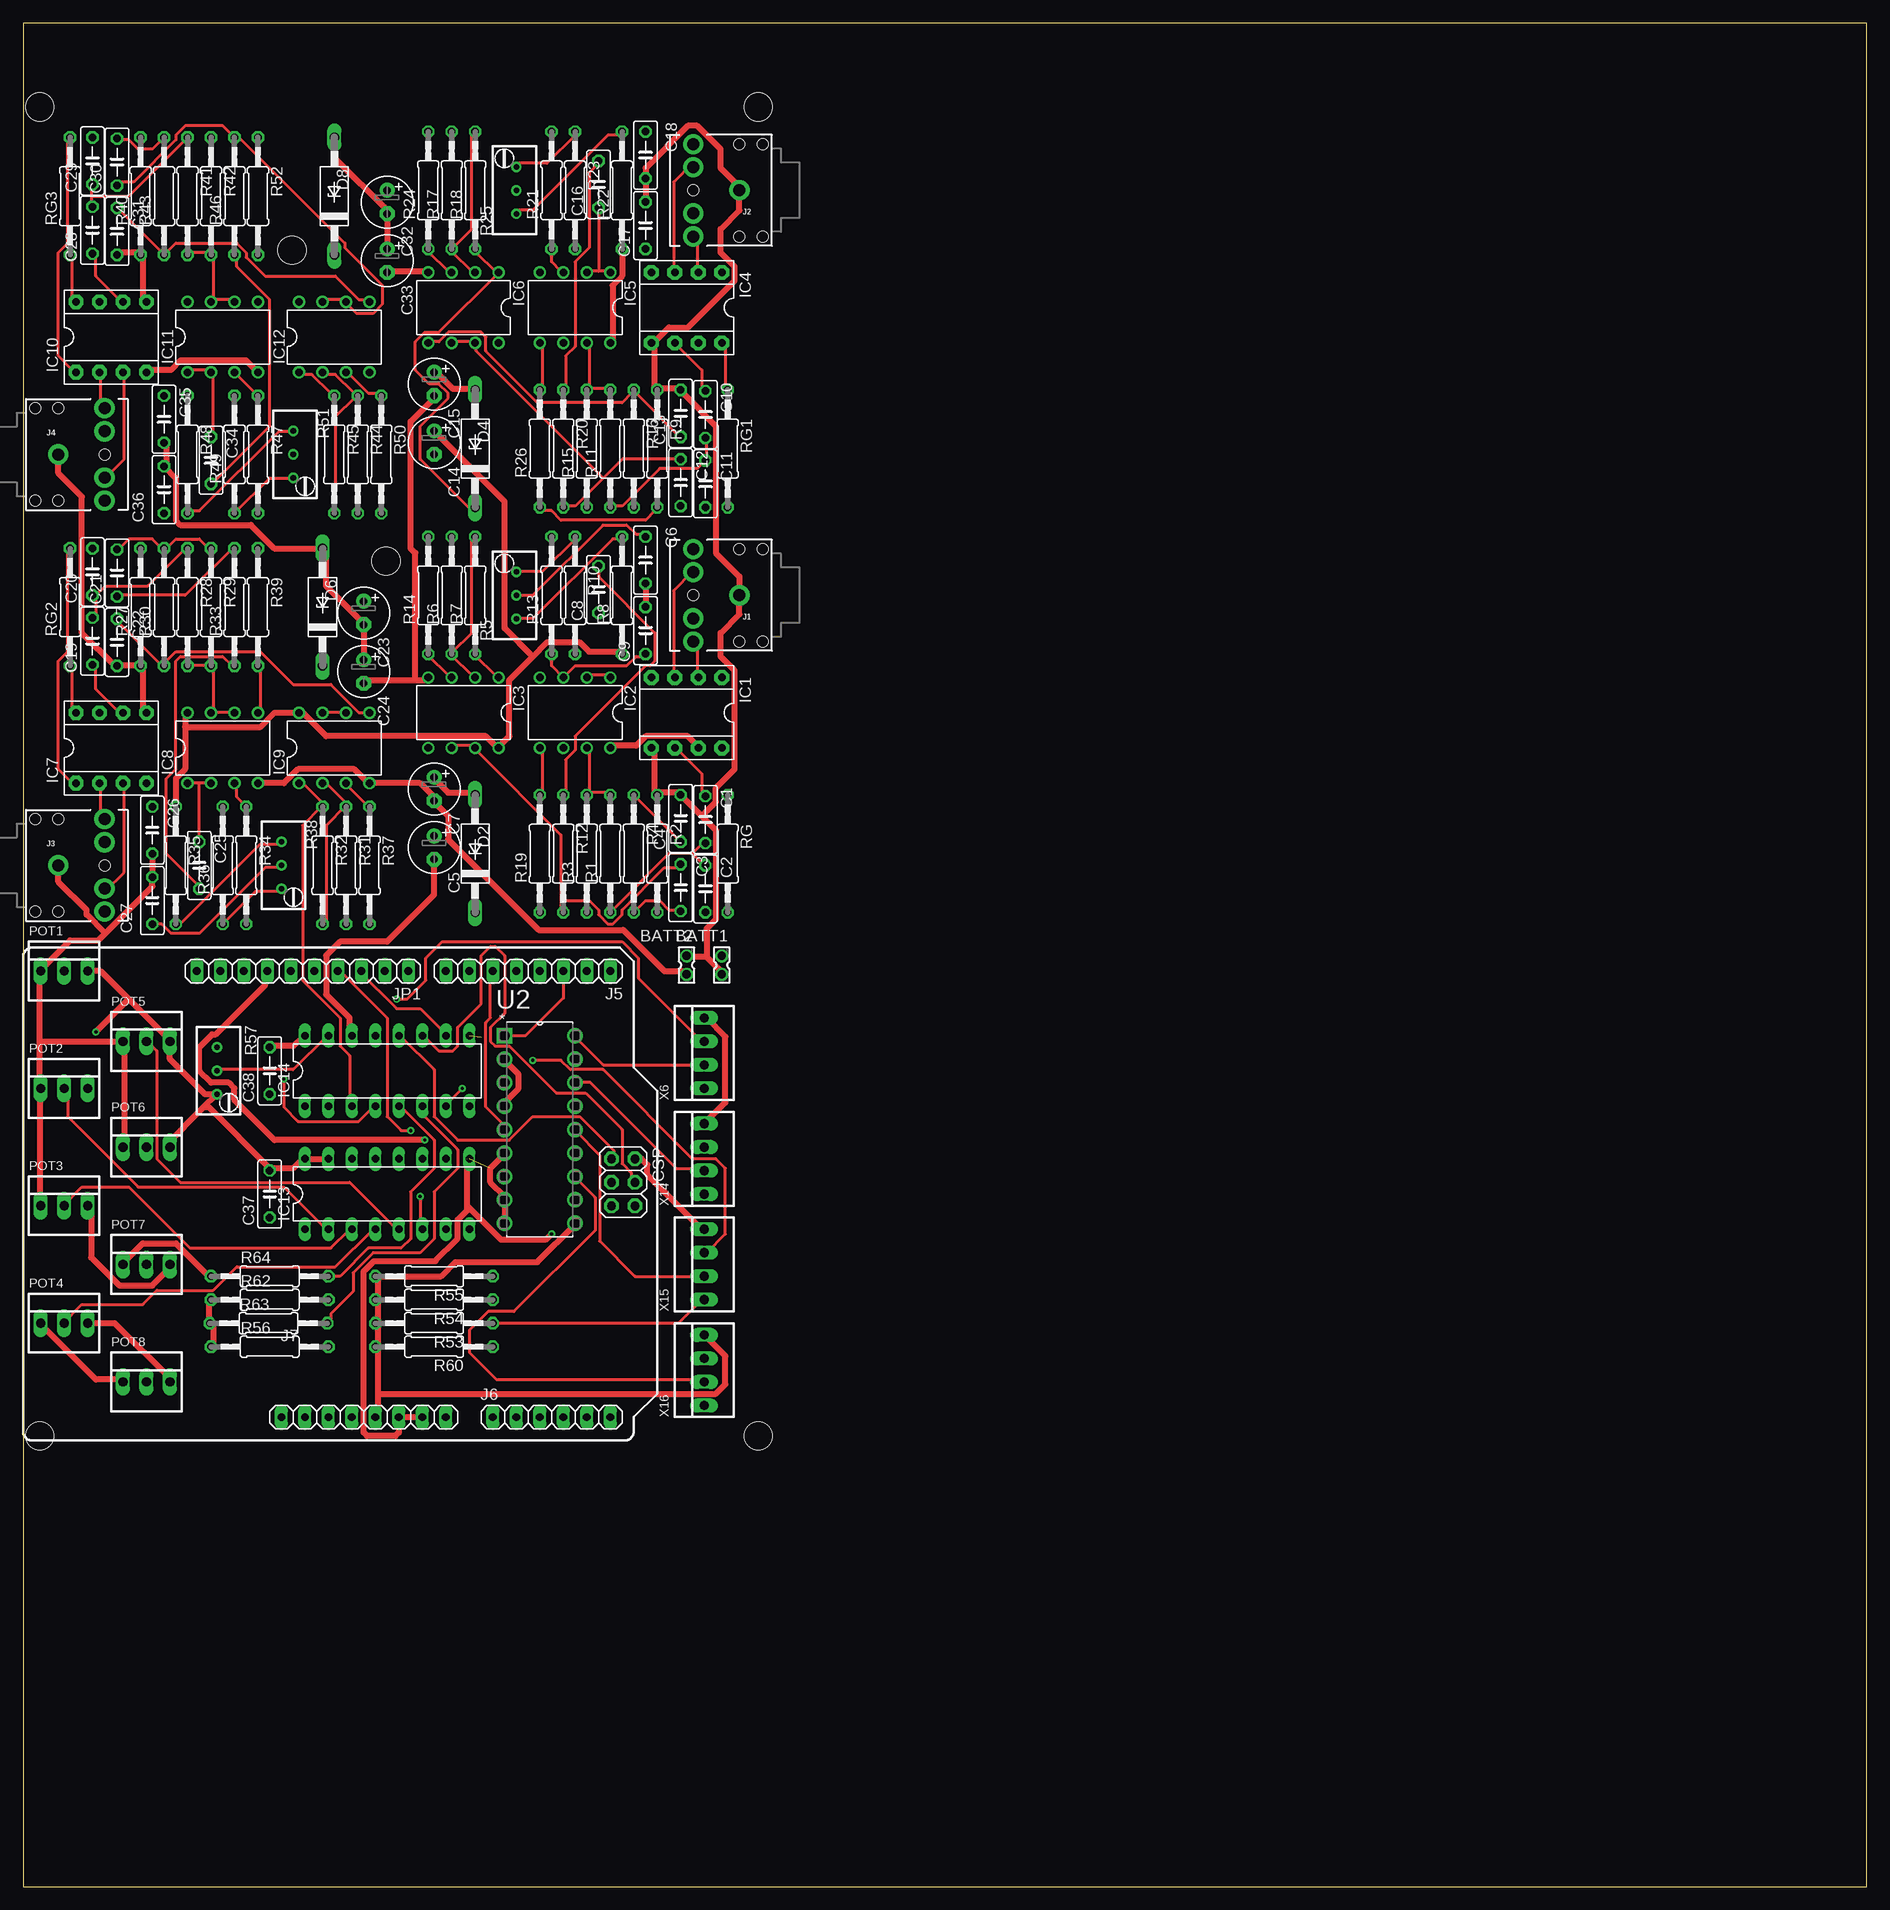
[diagram p5: board, top side]
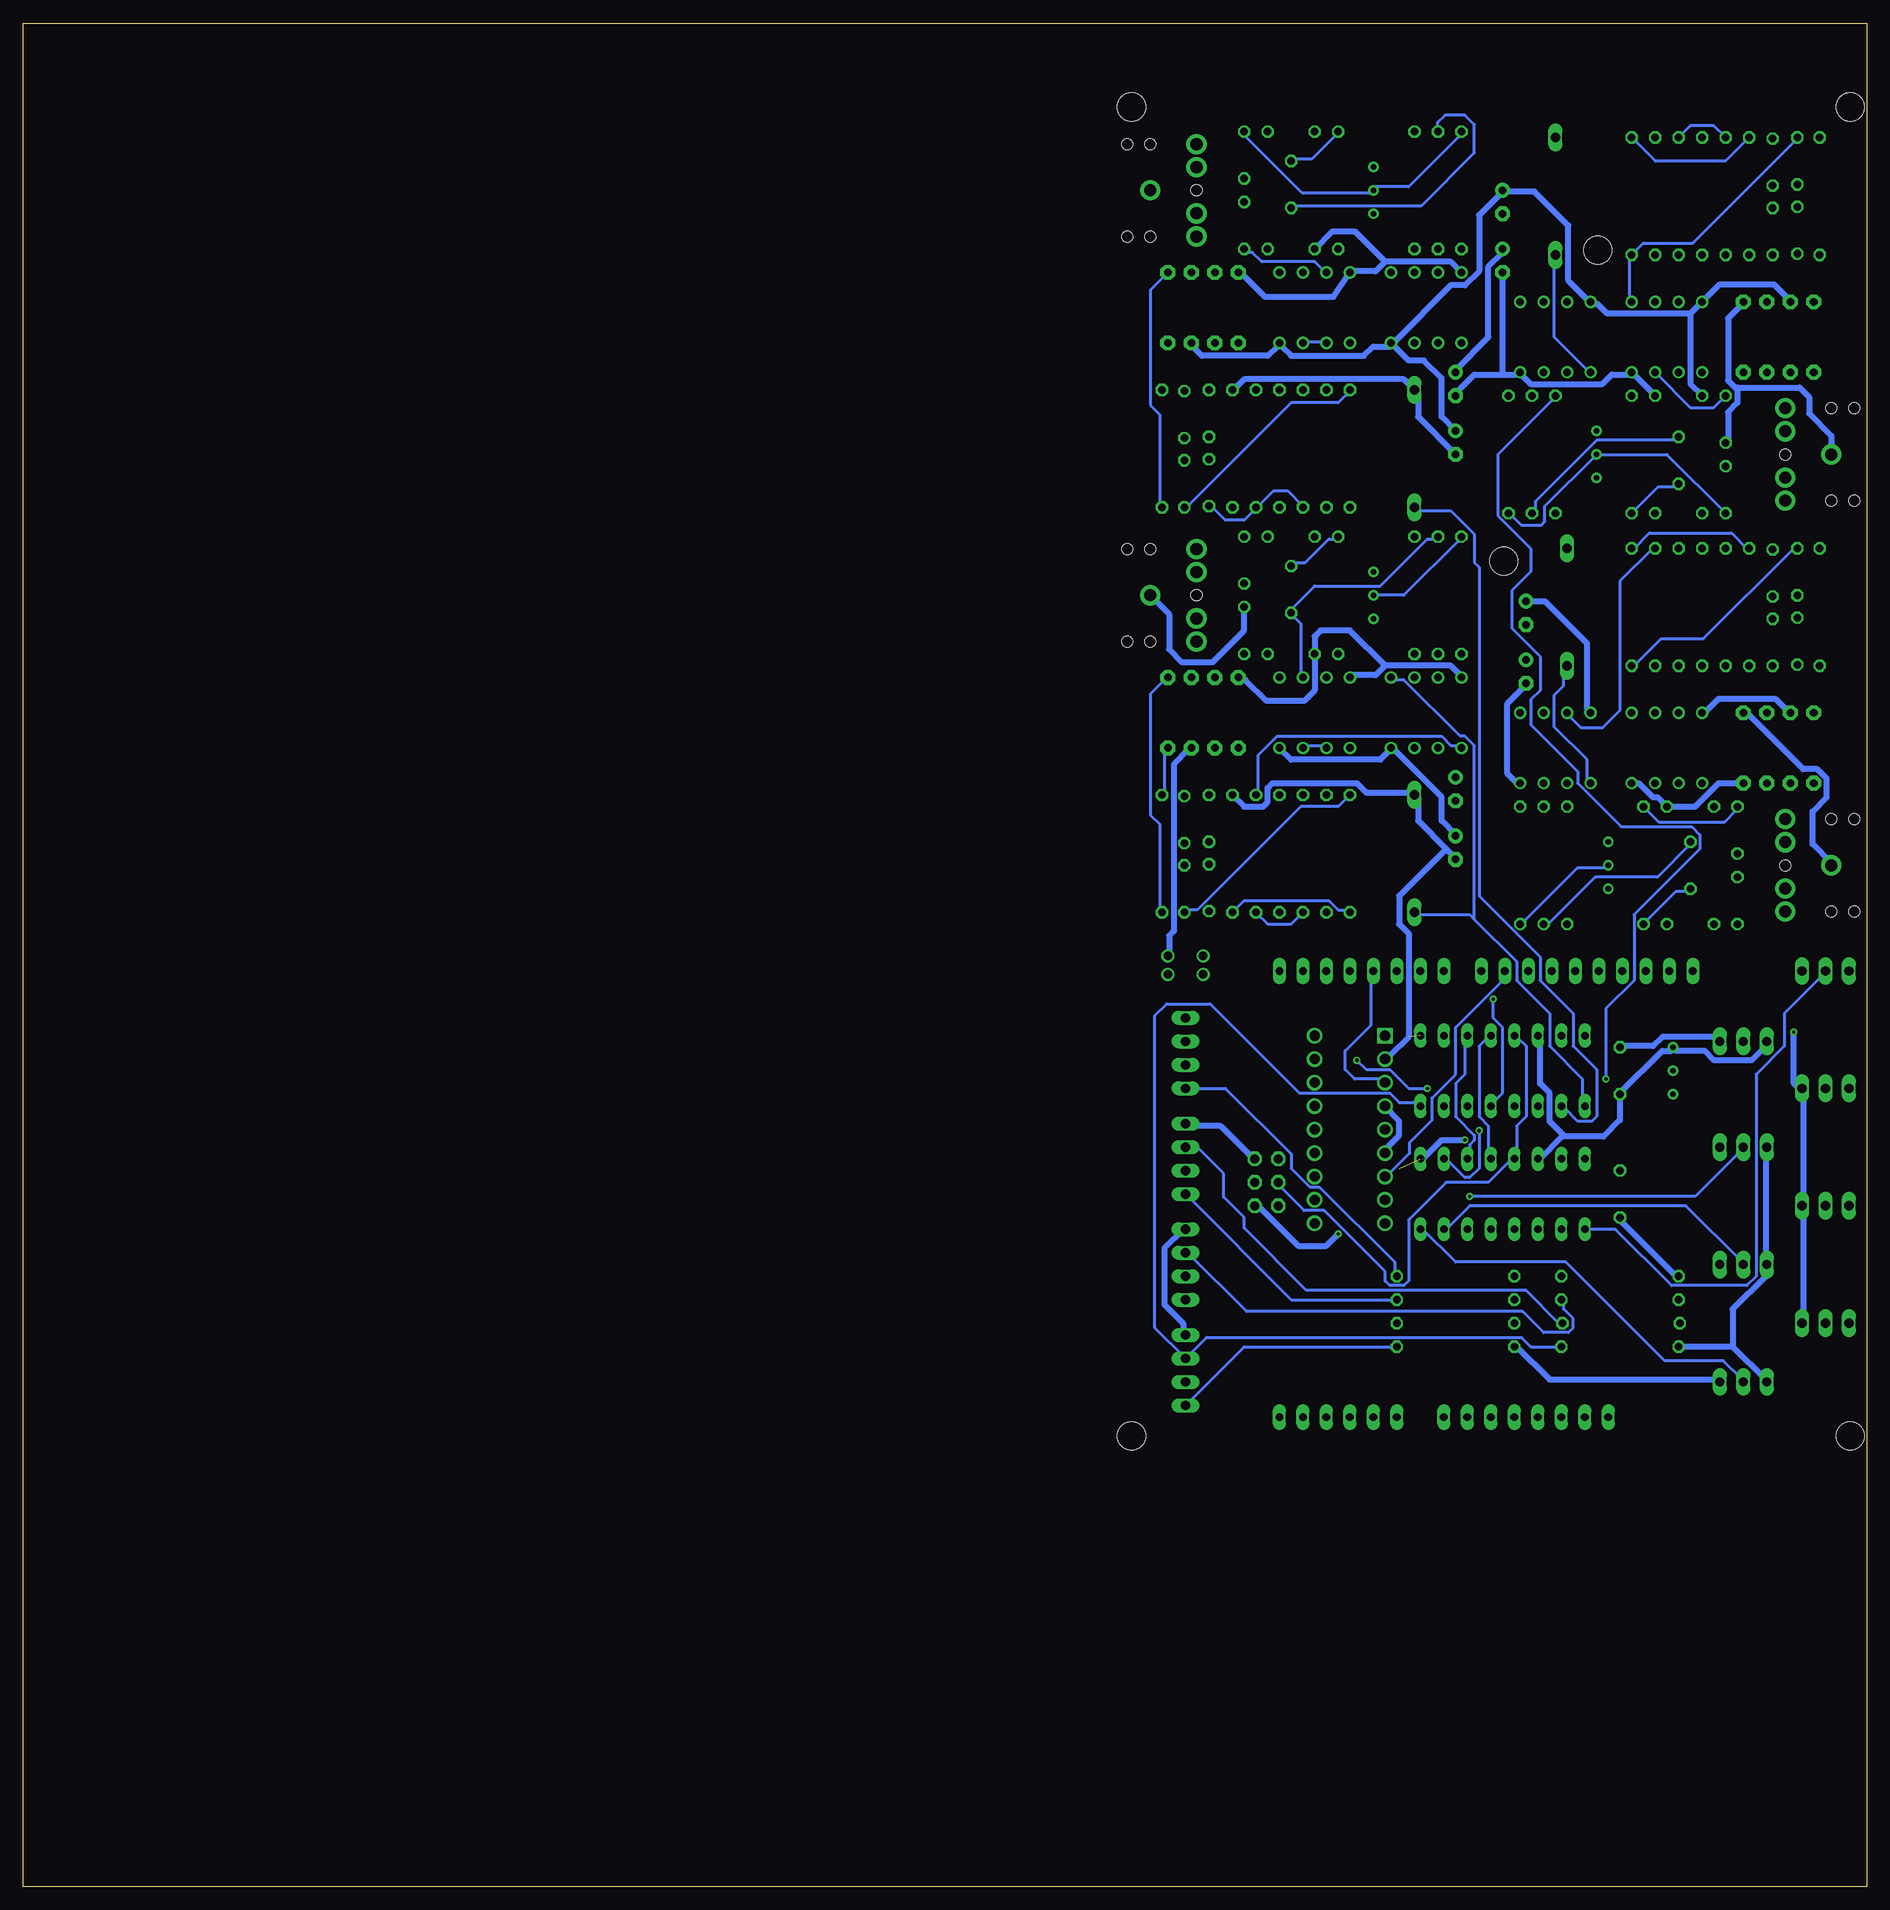
[diagram p6: board, bottom side, seen from below]

Size 199.37 x 201.6 mm. Coordinates in mm from the lower left corner, seen from the top.
Outline: 0,0 199.37,0 199.37,201.6 0,201.6 0,0
Copper layers (1*16): Top 0.035mm / dielectric 1.5mm / Bottom 0.035mm
Design rules "default": minimum track width 6mil, minimum drill 0.35mm, track to track 6mil, track to pad 6mil, pad to pad 6mil, via to via 6mil, smd to smd 6mil, copper to edge 40mil, drill to drill 6mil, minimum pad ring 10mil, minimum via ring 8mil, stop-mask expansion 4mil, vias tented up to drill 0mil, thermal gap 10mil
Holes 3.05 mm at 1.78,48.77 79.5,192.53 1.78,192.53 79.5,48.77 39.24,143.38 29.08,177.04
tKeepout: 4 lines

### Footprints (pad centres in the part's own frame; a part is rotated, then mirrored left to right if it is on the bottom)
332-02 = drill 0.9 pad 1.27: 1 0,-1; 2 0,1
C050-025X075 = drill 0.813 octagon: 1 -2.54,0; 2 2.54,0
E2,5-6 = drill 0.813 pad 1.6: + -1.27,0 | drill 0.813 pad 1.6 octagon: - 1.27,0
F126Z12 = drill 1.016 long: A 6.35,0; C -6.35,0
DIL08 = drill 0.813 pad 1.6 octagon: 1 -3.81,-3.81; 2 -1.27,-3.81; 3 1.27,-3.81; 4 3.81,-3.81; 5 3.81,3.81; 6 1.27,3.81; 7 -1.27,3.81; 8 -3.81,3.81
DIL08' = drill 0.813 pad 1.27: 1 -3.81,-3.81; 2 -1.27,-3.81; 3 1.27,-3.81; 4 3.81,-3.81; 5 3.81,3.81; 6 1.27,3.81; 7 -1.27,3.81; 8 -3.81,3.81
DIL16 = drill 0.813 long: 1 -8.89,-3.81; 2 -6.35,-3.81; 3 -3.81,-3.81; 4 -1.27,-3.81; 5 1.27,-3.81; 6 3.81,-3.81; 7 6.35,-3.81; 8 8.89,-3.81; 9 8.89,3.81; 10 6.35,3.81; 11 3.81,3.81; 12 1.27,3.81; 13 -1.27,3.81; 14 -3.81,3.81; 15 -6.35,3.81; 16 -8.89,3.81
2X03 = drill 0.95 pad 1.55 octagon: 1 -2.54,-1.27; 2 -2.54,1.27; 3 0,-1.27; 4 0,1.27; 5 2.54,-1.27; 6 2.54,1.27
AUDIO-JACK = drill 1.3 pad 2.184: RING 5,5; RSH 5,2.5; SLEEVE 0,0; TIP 5,-5; TSH 5,-2.5 | hole 1.2: 0,5; -2.5,5; -2.5,-5; 0,-5; 5,0
1X08 = drill 0.85 pad 1.422 long: 1 -8.89,0; 2 -6.35,0; 3 -3.81,0; 4 -1.27,0; 5 1.27,0; 6 3.81,0; 7 6.35,0; 8 8.89,0
1X06 = drill 0.85 pad 1.422 long: 1 -6.35,0; 2 -3.81,0; 3 -1.27,0; 4 1.27,0; 5 3.81,0; 6 6.35,0
1X10 = drill 0.85 pad 1.422 long: 1 -11.43,0; 2 -8.89,0; 3 -6.35,0; 4 -3.81,0; 5 -1.27,0; 6 1.27,0; 7 3.81,0; 8 6.35,0; 9 8.89,0; 10 11.43,0
22-23-2031 = drill 1 long: 1 -2.54,0; 2 0,0; 3 2.54,0
0207/12 = drill 0.813 octagon: 1 -6.35,0; 2 6.35,0
RTRIMT93YA = drill 0.61: 1 0,-2.54; 2 0,0; 3 0,2.54
DIP254P762X393-18 = drill 1.118 square: 1 -7.62,20.32 | drill 1.118: 2 -7.62,17.78; 3 -7.62,15.24; 4 -7.62,12.7; 5 -7.62,10.16; 6 -7.62,7.62; 7 -7.62,5.08; 8 -7.62,2.54; 9 -7.62,0; 10 0,0; 11 0,2.54; 12 0,5.08; 13 0,7.62; 14 0,10.16; 15 0,12.7; 16 0,15.24; 17 0,17.78; 18 0,20.32
22-23-2041 = drill 1 long: 1 -3.81,0; 2 -1.27,0; 3 1.27,0; 4 3.81,0

### Placement (x,y rotation side)
BATT1  75.56,99.69 180 top
BATT2  71.75,99.69 180 top
C1  73.79,115.44 270 top
C2  73.79,107.95 270 top
C3  71.12,108.08 270 top
C4  71.12,115.57 90 top
C5  44.45,112.39 270 top
C6  67.31,143.51 270 top
C7  44.45,118.74 270 top
C8  62.23,140.33 90 top
C9  67.31,135.89 90 top
C10  73.79,159.26 270 top
C11  73.79,151.76 270 top
C12  71.12,151.89 270 top
C13  71.12,159.38 90 top
C14  44.45,156.21 270 top
C15  44.45,162.56 270 top
C16  62.23,184.15 90 top
C17  67.31,179.7 90 top
C18  67.31,187.32 270 top
C19  7.49,134.75 90 top
C20  7.49,142.24 90 top
C21  10.16,142.11 90 top
C22  10.16,134.62 270 top
C23  36.83,137.79 270 top
C24  36.83,131.44 270 top
C25  19.05,110.49 270 top
C26  13.97,114.3 270 top
C27  13.97,106.68 90 top
C28  7.49,179.2 90 top
C29  7.49,186.69 90 top
C30  10.16,186.56 90 top
C31  10.16,179.07 270 top
C32  39.37,182.25 270 top
C33  39.37,175.89 270 top
C34  20.32,154.31 270 top
C35  15.24,158.75 270 top
C36  15.24,151.13 90 top
C37  26.67,74.93 90 top
C38  26.67,88.26 90 top
D2  48.89,111.76 90 top
D4  48.89,155.57 90 top
D6  32.38,138.43 90 top
D8  33.66,182.88 90 top
IC1  71.75,127 180 top
IC2  OP275P  [DIL08']  59.69,127 180 top
IC3  OP275P  [DIL08']  47.62,127 180 top
IC4  71.75,170.81 180 top
IC5  OP275P  [DIL08']  59.69,170.81 180 top
IC6  OP275P  [DIL08']  47.62,170.81 180 top
IC7  9.52,123.19 0 top
IC8  OP275P  [DIL08']  21.59,123.19 0 top
IC9  OP275P  [DIL08']  33.66,123.19 0 top
IC10  9.52,167.64 0 top
IC11  OP275P  [DIL08']  21.59,167.64 0 top
IC12  OP275P  [DIL08']  33.66,167.64 0 top
IC13  39.37,74.93 0 top
IC14  39.37,88.26 0 top
ICSP  64.9,76.2 270 top
J1  77.47,139.7 180 top
J2  77.47,183.51 180 top
J3  3.81,110.49 0 top
J4  3.81,154.94 0 top
J5  54.61,99.06 180 top
J6  57.15,50.8 0 top
J7  36.83,50.8 0 top
JP1  30.23,99.06 180 top
POT1  4.45,99.06 0 top
POT2  4.45,86.36 0 top
POT3  4.45,73.66 0 top
POT4  4.45,60.96 0 top
POT5  13.33,91.44 0 top
POT6  13.33,80.01 0 top
POT7  13.33,67.31 0 top
POT8  13.33,54.61 0 top
R1  63.5,111.76 90 top
R2  68.58,111.76 270 top
R3  60.96,111.76 90 top
R4  66.04,111.76 270 top
R5  53.34,139.7 0 top
R6  46.35,139.7 90 top
R7  48.89,139.7 90 top
R8  64.77,139.7 90 top
R9  68.58,155.57 270 top
R10  59.69,139.7 270 top
R11  63.5,155.57 90 top
R12  58.42,111.76 270 top
R13  57.15,139.7 90 top
R14  43.81,139.7 90 top
R15  60.96,155.57 90 top
R16  66.04,155.57 270 top
R17  46.35,183.51 90 top
R18  48.89,183.51 90 top
R19  55.88,111.76 90 top
R20  58.42,155.57 270 top
R21  57.15,183.51 90 top
R22  64.77,183.51 90 top
R23  59.69,183.51 270 top
R24  43.81,183.51 90 top
R25  53.34,183.51 0 top
R26  55.88,155.57 90 top
R27  12.7,138.43 90 top
R28  17.78,138.43 270 top
R29  20.32,138.43 270 top
R30  15.24,138.43 90 top
R31  34.92,110.49 270 top
R32  32.38,110.49 270 top
R33  22.86,138.43 90 top
R34  24.13,110.49 270 top
R35  16.51,110.49 270 top
R36  21.59,110.49 90 top
R37  37.46,110.49 270 top
R38  27.94,110.49 180 top
R39  25.4,138.43 270 top
R40  12.7,182.88 90 top
R41  17.78,182.88 270 top
R42  20.32,182.88 270 top
R43  15.24,182.88 90 top
R44  36.2,154.94 270 top
R45  33.66,154.94 270 top
R46  22.86,182.88 90 top
R47  25.4,154.94 270 top
R48  17.78,154.94 270 top
R49  22.86,154.94 90 top
R50  38.73,154.94 270 top
R51  29.21,154.94 180 top
R52  25.4,182.88 270 top
R53  44.45,60.96 180 top
R54  44.45,63.5 180 top
R55  44.45,66.04 180 top
R56  26.67,58.42 0 top
R57  20.95,88.26 180 top
R60  44.45,58.42 180 top
R62  26.67,63.5 0 top
R63  26.54,60.96 0 top
R64  26.67,66.04 0 top
RG  76.2,111.76 270 top
RG1  76.2,155.57 270 top
RG2  5.08,138.43 90 top
RG3  5.08,182.88 90 top
U2  59.69,71.75 0 top
X6  73.66,90.17 90 top
X14  73.66,78.74 90 top
X15  73.66,67.31 90 top
X16  73.66,55.88 90 top

### Tracks (layer width: path | path; a pad name or v marks a point on that pad's centre or on a via)
0  (2 unrouted)
  Top 0.635: D8.A 33.78,188.98 33.78,186.94 39.37,181.36 C32.- C33.+ | C17.2 C18.2 67.31,185.93 71.88,190.5 72.9,190.5 75.44,187.96 75.44,185.93 77.47,183.9 J2.SLEEVE 77.47,181.36 75.44,179.32 75.44,176.78 76.96,175.26 76.96,173.74 71.88,168.66 69.85,168.66 68.33,167.13 IC4.5 68.33,166.62 68.33,162.05 R9.1 68.83,162.05 70.87,162.05 C13.2 71.37,161.54 74.93,157.99 74.93,144.27 77.47,141.73 J1.SLEEVE 77.47,137.67 75.44,135.64 75.44,133.1 76.96,131.57 76.96,120.9 74.93,118.87 74.93,117.35 73.41,115.82 | C6.2 C9.2 | D4.A 48.51,162.05 46.48,162.05 44.45,164.08 C15.+ | U2.9 U2.8 52.07,74.68 50.55,76.2 50.55,77.72 52.07,79.25 U2.6 | U2.2 52.07,89.41 53.59,87.88 53.59,86.36 52.07,84.84 U2.4 | D2.A 48.51,118.36 45.97,118.36 44.45,119.89 C7.+ | 73.91,100.58 71.88,100.58 BATT2.1 | 73.91,100.58 75.44,99.06 BATT1.2 | IC1.5 68.33,122.94 68.33,118.36 R2.1 68.83,118.36 70.87,118.36 C4.2 73.41,115.82 | 73.91,100.58 73.91,103.63 74.93,104.65 74.93,114.3 73.41,115.82 | C24.+ C23.- 36.83,136.65 32.77,140.72 32.77,144.78 D6.A 27.18,144.78 24.64,147.32 17.02,147.32 16.51,147.83 16.51,152.4 C36.2 15.49,153.92 15.49,155.96 C35.2 | C31.2 10.41,176.78 12.45,176.78 R40.1 12.95,176.28 12.95,171.7 IC10.5 | R62.1 20.07,63.5 20.07,60.96 R63.1 20.57,60.96 20.57,58.42 R56.1 | POT4.1 2.29,60.96 2.29,60.45 7.87,54.86 10.41,54.86 POT8.1 | R64.1 20.07,66.04 16.51,69.6 12.95,69.6 10.92,67.56 POT7.1 | IC7.5 12.95,127 12.95,132.08 R27.1 C22.2 9.91,132.08 6.35,135.64 6.35,150.37 3.81,152.91 J4.SLEEVE | C26.2 C27.2 13.97,108.2 8.89,103.12 | 1.78,86.36 1.78,73.66 POT3.1 | 1.78,86.36 1.78,91.44
  Top 0.635: 1.78,91.44 1.78,99.06 | 1.78,86.36 POT2.1 | 1.78,91.44 POT5.1 10.92,91.44 10.92,80.26 POT6.1 | 8.89,103.12 8.13,102.36 5.08,102.36 1.78,99.06 | 1.78,99.06 POT1.1 | J3.SLEEVE 3.81,108.71 6.86,105.66 6.86,105.16 8.89,103.12 | C5.- 44.45,107.31 39.37,102.23 34.29,102.23 32.77,100.71 32.77,96.52 35.31,93.98 35.31,92.46 IC14.14
  Bottom 0.635: C9.2 67.31,135.89 70.74,132.46 74.04,132.46 75.44,133.86 75.44,137.67 J1.SLEEVE | C14.- 48.51,159 48.51,161.54 D4.A 50.04,163.07 67.31,163.07 68.33,162.05 R9.1 | C33.+ 39.37,176.78 40.89,175.26 40.89,167.64 44.45,164.08 C15.+ | U2.4 52.07,84.33 50.55,82.8 50.55,81.28 52.07,79.76 U2.6 | 45.47,112.27 48.51,115.32 48.51,117.86 D2.A 49.02,118.36 54.1,118.36 55.12,119.38 64.26,119.38 64.77,118.87 64.77,117.35 65.28,116.84 67.31,116.84 R2.1 | 45.47,112.27 44.45,111.25 C5.- | 45.47,112.27 50.55,107.19 50.55,104.14 49.53,103.12 49.53,91.95 51.56,89.92 52.07,89.92 U2.2 | 13.97,161.93 13.97,162.18 7.24,162.18 6.22,161.16 6.22,159.38 3.81,156.97 J4.SLEEVE | 13.97,161.93 13.97,160.53 14.99,159.51 14.99,156.46 C35.2 | 13.97,161.93 14.99,162.94 14.99,169.67 13.46,171.2 IC10.5 | 14.48,58.42 R56.1 | 14.48,58.42 10.92,54.86 POT8.1 | R64.1 20.57,66.04 26.67,72.14 C37.1 | POT6.1 10.92,79.76 10.92,67.56 POT7.1 10.92,67.06 10.92,66.04 14.48,62.48 14.48,58.42 | 32.89,81.15 32.77,81.28 34.29,82.8 34.29,85.85 35.31,86.87 35.31,91.95 IC14.14 | 32.89,81.15 35.31,78.74 IC13.14 | 32.89,81.15 28.45,81.15 26.67,82.93 C38.1 26.67,85.85 22.1,90.42 21.08,90.42 R57.1 20.57,90.42 17.53,90.42 16.51,89.41 12.45,89.41 10.41,91.44 POT5.1 | IC7.5 12.95,127 6.86,120.9 5.33,120.9 4.32,119.89 4.32,117.86 5.84,116.33 5.84,112.78 3.81,110.74 J3.SLEEVE
+5V  (via drill 0.35)
  Top 0.635: 26.67,77.72 29.21,77.72 30.23,78.74 IC13.16 IC13.15 | C38.2 26.67,90.93 29.21,90.93 30.23,91.95 IC14.16 | 19.56,84.33 15.49,80.26 POT6.3 | 19.56,84.33 R57.3 19.68,85.72 15.87,89.53 15.87,91.31 16,91.44 | POT1.3 8.38,99.06 11.43,96.01 | 16,91.44 11.43,96.01 | 16,91.44 POT5.3 | 26.67,77.72 20.07,84.33 19.56,84.33 | 26.67,77.72 C37.2 | X14.4 75.95,84.84 75.95,91.95 73.91,93.98 X6.4 | X15.4 73.41,71.12 67.5,77.02 67.5,78.1 66.86,78.74 ICSP.2 | POT4.3 9.91,60.96 16,54.86 POT8.3 | POT7.3 15.49,67.06 15.49,66.55 13.97,65.02 10.41,65.02 7.37,68.07 7.37,73.66 POT3.3 | 38.35,60.96 38.35,58.42 | 38.35,58.42 38.35,53.34 | 38.35,53.34 38.35,50.8 J7.5 | 38.35,58.42 R60.2 | 38.35,66.04 38.35,63.5 | 38.35,66.04 45.21,66.04 46.74,67.56 55.63,67.56 59.69,71.63 U2.10 | 38.35,66.04 R55.2 | 38.35,63.5 38.35,60.96 | 38.35,60.96 R53.2 | 38.35,63.5 R54.2 | X16.4 75.95,57.4 75.95,54.36 74.93,53.34 38.35,53.34 | v7.87,92.46 11.43,96.01
  Bottom 0.635: C38.2 26.67,90.93 23.11,90.93 22.1,91.95 16.51,91.95 16,91.44 POT5.3 | X16.4 73.91,59.94 73.91,60.96 75.95,62.99 75.95,69.09 73.91,71.12 X15.4 | X14.4 73.41,82.3 69.85,82.3 66.29,78.74 ICSP.2 | 6.86,73.66 6.86,86.36 POT2.3 7.37,86.36 7.87,86.87 v7.87,92.46 | 6.86,73.66 6.86,60.96 POT4.3 | 6.86,73.66 POT3.3 | POT8.3 16,54.86 34.29,54.86 37.85,58.42 R60.2
+9V
  Top 0.635: R22.1 64.77,174.24 63.75,173.23 63.75,167.13 IC5.8 | R35.1 16.51,119.89 17.53,120.9 17.53,125.48 | 17.53,125.48 17.53,127 IC8.8 | 17.53,125.48 25.65,125.48 27.18,127 IC9.8 30.23,127 32.77,124.46 50.04,124.46 51.05,123.44 IC3.8 51.56,123.44 52.58,124.46 52.58,130.56 55.12,133.1 | IC2.8 63.75,123.44 66.29,123.44 67.31,124.46 71.88,124.46 72.9,123.44 IC1.7 | 55.12,133.1 56.64,134.62 60.2,134.62 61.21,133.6 64.77,133.6 R8.1 | C14.+ 52.07,149.86 52.07,136.14 55.12,133.1
  Bottom 0.635: IC6.8 49.53,165.1 47.88,165.1 45.97,163.19 45.97,159 C14.+ | IC4.7 72.9,166.62 71.88,165.61 64.77,165.61 63.75,166.62 IC5.8 63.25,166.62 62.23,165.61 54.36,165.61 53.34,166.62 51.56,166.62 IC6.8 | R48.1 19.05,162.56 19.05,170.18 | 19.05,170.18 IC11.8 15.87,173.35 10.03,173.35 8.38,171.7 IC10.7 | 19.05,170.18 28.07,170.18 29.08,171.2 29.72,171.2 IC12.8 30.23,171.7 32.26,173.74 32.26,179.7 35.94,183.39 39.37,183.39 | 39.37,183.39 41.91,180.85 41.91,174.75 43.43,173.23 44.96,173.23 51.05,167.13 IC6.8 | 39.37,183.39 C32.+ | IC7.7 8.38,127 9.91,128.52 16,128.52 17.53,127 IC8.8 | C23.+ 34.8,139.06 30.23,134.49 30.23,127 IC9.8 | BATT1.1 75.44,101.09 75.44,102.87 74.93,103.38 74.93,121.41 73.41,122.94 IC1.7 | C5.+ 44.45,113.79 45.97,115.32 45.97,117.86 51.05,122.94 IC3.8 51.56,122.94 52.58,121.92 62.23,121.92 IC2.8
-9V
  Top 0.635: IC11.4 24.13,165.1 17.02,165.1 16,164.08 13.46,164.08 IC10.4 | IC6.4 43.43,174.75 39.37,174.75 C33.- | 42.42,130.56 36.83,130.56 C24.- | 42.42,130.56 43.43,130.56 IC3.4 | BATT2.2 71.37,99.06 69.34,99.06 64.9,103.5 55.75,103.5 45.97,113.28 45.97,115.82 44.45,117.35 C7.- 44.45,117.86 42.93,119.38 IC9.4 37.34,119.38 35.81,120.9 29.72,120.9 28.19,119.38 IC8.4 | 42.42,130.56 42.42,144.27 41.91,144.78 41.91,158.5 44.45,161.04 C15.-
  Bottom 0.635: 56.13,174.75 IC5.4 | 59.69,176.78 R23.2 57.78,179.07 55.37,179.07 52.07,175.77 | IC4.4 67.82,174.24 67.31,174.24 65.02,171.96 57.66,171.96 IC5.4 | R49.2 IC11.4 25.65,163.58 27.56,163.58 28.57,162.56 36.32,162.56 37.34,163.58 IC12.4 37.85,163.58 39.37,163.58 | 39.37,163.58 42.42,163.58 44.45,161.54 C15.- | 39.37,163.58 C33.- | 52.07,175.77 53.09,174.75 55.63,174.75 IC5.4 | 52.07,175.77 44.96,175.77 IC6.4 | IC1.4 67.82,130.56 67.18,130.56 64.9,128.27 60.83,128.27 59.69,129.41 R10.2 59.69,135.25 59.05,135.89 55.88,135.89 52.07,132.08 | IC8.4 24.64,119.38 23.11,117.86 22.61,117.86 R36.2 18.54,116.84 16,119.38 IC7.4 | C24.- 36.83,130.05 38.86,128.02 38.86,120.4 37.85,119.38 IC9.4 | 52.07,132.08 53.09,131.06 55.63,131.06 IC2.4 | 52.07,132.08 44.96,132.08 43.94,131.06 IC3.4
ARDUINO1
  Top 0.305: U2.1 54.36,92.07 58.42,96.14 J5.3
ARDUINO2
  Bottom 0.305: J5.5 53.59,99.06 53.59,93.22 56.39,90.42 56.39,88.39 55.37,87.38 52.07,87.38 U2.3
ARDUINO3
  Top 0.305: J5.6 50.55,99.06 50.55,93.98 50.04,93.47 50.04,84.33 52.07,82.3 U2.5
ARDUINO4
  Bottom 0.305: JP1.2 39.37,99.06 39.37,98.04 44.45,92.96 44.45,87.88 46.99,85.34 46.99,82.93 49.4,80.52 49.4,79.38 52.07,76.71 U2.7
CLK
  Bottom 0.305: IC14.13 37.85,91.95 36.83,90.93 36.83,83.31 37.85,82.3 37.85,78.74 IC13.13 38.35,78.74 40.89,76.2 45.47,76.2 49.53,72.14 49.53,65.53 50.04,65.02 51.56,65.02 52.07,65.53 52.07,66.55 58.67,73.15 60.83,73.15 63.63,75.95 ICSP.3
CS1
  Top 0.305: IC14.10 45.47,92.46 42.93,95 40.39,95 36.32,99.06 JP1.3
CS2  (via drill 0.35)
  Top 0.305: v41.91,81.79 40.89,81.79 39.37,83.31 39.37,93.98 34.29,99.06 JP1.4
  Bottom 0.305: v41.91,81.79 41.91,77.72 42.93,76.71 43.43,76.71 45.47,78.74 IC13.10
DGND  (via drill 0.35)  (1 unrouted)
  Top 0.635: 48.01,73.66 48.01,73.15 46.99,72.14 46.99,70.1 44.58,67.69 37.97,67.69 36.83,66.55 36.83,49.15 37.21,48.77 40.26,48.77 40.64,49.15 J7.6 J7.7 | 48.01,73.66 48.01,78.74 | v43.43,80.77 27.18,80.77 22.86,85.09 22.86,86.36 22.22,86.99 20.32,86.99 19.05,88.26 19.05,90.8 20.45,92.2 20.83,92.2 26.16,97.54 26.16,99.06 JP1.7 | v57.15,70.61 56.52,69.98 51.69,69.98 48.01,73.66
  Bottom 0.635: v43.43,80.77 45.97,80.77 48.01,78.74 | v57.15,70.61 58.42,69.34 61.47,69.34 65.79,73.66 ICSP.6
DIN
  Top 0.305: ICSP.4 65.79,76.2 65.79,77.22 64.77,78.23 64.77,81.91 60.83,85.85 57.66,85.85 52.58,90.93 51.05,90.93 50.55,91.44 50.55,92.96 52.07,94.49 52.07,100.71 51.05,101.73 50.55,101.73 49.53,100.71 49.53,95.5 46.99,92.96 46.99,90.93 46.48,90.42 44.96,90.42 43.43,91.95 IC14.11
  Bottom 0.305: IC13.11 42.93,78.74 42.93,80.26 42.42,80.77 42.42,81.28 44.45,83.31 44.45,86.87 43.43,87.88 43.43,91.95 IC14.11
DOUT
  Top 0.305: ICSP.1 63.88,78.99 63.88,79.63 60.2,83.31 55.12,83.31 52.58,80.77 46.99,80.77 44.45,83.31 44.45,88.39 40.89,91.95 IC14.12
  Bottom 0.305: IC13.12 40.89,78.74 40.89,82.3 41.91,83.31 41.91,90.93 40.89,91.95 IC14.12
EMG1
  Top 0.305: R7.1 49.02,133.1 51.05,131.06 IC3.1
  Bottom 0.305: 42.42,104.65 42.93,105.16 48.51,105.16 D2.C | 42.42,104.65 37.85,100.08 37.85,98.04 34.29,94.49 34.29,90.93 30.73,87.38 30.73,84.84 IC14.1 | 42.42,104.65 42.42,123.44 43.43,124.46 43.94,124.46 50.04,130.56 51.05,130.56 IC3.1
EMG2
  Top 0.305: R18.1 49.02,176.78 51.05,174.75 IC6.1 44.96,168.15 43.43,168.15 42.42,167.13 42.42,164.08 43.94,162.56 44.96,162.56 45.97,161.54 45.97,161.04 42.93,157.99 42.93,154.43 48.51,148.84 D4.C
  Bottom 0.305: IC14.2 32.77,84.33 31.24,82.8 29.72,82.8 29.21,83.31 29.21,88.39 31.75,90.93 31.75,94.49 35.31,98.04 35.31,100.58 41.91,107.19 41.91,142.75 42.42,143.26 42.42,146.3 44.96,148.84 48.51,148.84 D4.C
EMG3
  Top 0.305: IC9.1 30.23,119.38 32.77,116.84 R32.1 32.26,116.84 30.23,114.81 30.23,98.04 34.29,93.98 34.29,90.93 35.31,89.92 35.31,84.84 IC14.3
  Bottom 0.305: D6.C 32.77,132.08 32.77,129.92 33.78,128.91 33.78,125.48 30.23,121.92 30.23,119.38 IC9.1
EMG4  (via drill 0.35)
  Top 0.305: IC12.1 30.23,163.58 31.24,163.58 33.27,161.54 R45.1 | v28.19,87.38 28.19,84.33 29.72,82.8 36.32,82.8 37.85,84.33 IC14.4
  Bottom 0.305: v28.19,87.38 28.19,95 25.15,98.04 25.15,105.16 18.03,112.27 18.03,113.79 18.92,114.68 26.54,114.68 31.24,119.38 31.24,120.65 36.32,125.73 36.32,128.4 35.31,129.41 35.31,133.1 38.35,136.14 38.35,140.21 36.32,142.24 36.32,144.78 39.88,148.34 39.88,154.94 33.78,161.04 R45.1 | D8.C 33.78,176.28 33.78,167.64 30.23,164.08 IC12.1
N$1
  Bottom 0.305: RG.2 76.45,105.66 76.45,114.94 77.47,115.95 77.47,129.03 75.95,130.56 IC1.1
N$2
  Bottom 0.305: RG.1 75.95,118.36 75.95,122.94 IC1.8
N$3
  Top 0.305: IC1.2 72.9,131.06 72.9,134.62 J1.RING
N$4
  Top 0.305: C8.2 62.23,141.73 68.33,135.64 68.33,132.59 67.82,132.08 67.31,132.08 59.69,124.46 59.69,122.94 58.67,121.92 58.67,118.36 R12.1
  Bottom 0.305: R13.2 57.15,145.8 58.17,145.8 60.71,143.26 62.23,143.26 C8.2
N$5
  Top 0.305: R1.1 69.85,111.76 72.39,111.76 | 72.39,111.76 73.41,112.78 C1.2 | 72.39,111.76 73.41,110.74 C2.1
N$6
  Top 0.305: C1.1 73.41,118.36 73.41,120.4 70.87,122.94 IC1.6
N$7
  Top 0.305: R19.2 56.13,118.36 56.13,122.94 IC2.5
  Bottom 0.305: R19.2 57.15,116.84 61.21,116.84 72.39,105.66 73.41,105.66 C2.2
N$8
  Top 0.305: 61.21,118.36 63.25,118.36 R1.2 | 61.21,118.36 61.21,122.94 IC2.7 | 61.21,118.36 R3.2
  Bottom 0.305: IC2.6 58.67,123.44 60.71,123.44 IC2.7
N$9
  Top 0.305: R4.2 67.31,106.68 68.83,106.68 69.85,105.66 70.87,105.66 C3.2
  Bottom 0.305: R3.1 62.23,104.14 64.77,104.14 R4.2
N$10
  Top 0.305: R4.1 C4.1
  Bottom 0.305: IC3.5 43.94,123.44 44.96,123.44 45.97,124.46 63.75,124.46 65.79,122.43 65.79,118.36 R4.1
N$11
  Top 0.305: 58.17,106.68 58.17,113.79 49.02,122.94 IC3.7 48.51,123.44 46.48,123.44 IC3.6 | 58.17,106.68 58.17,105.66 R12.2 | 58.17,106.68 61.21,106.68 62.23,105.66 62.23,105.16 63.25,104.14 63.75,104.14 64.77,105.16 64.77,105.66 69.34,110.24 70.87,110.24 C3.1
N$12
  Top 0.305: X6.2 62.74,88.9 59.69,91.95 U2.18
N$14
  Top 0.305: R13.1 57.15,132.08 IC2.3 59.69,132.08 65.28,132.08 66.29,133.1 67.31,133.1 C9.1
N$15
  Top 0.305: R5.3 56.13,142.24 59.69,145.8 R10.1
N$16
  Top 0.305: R5.2 55.12,139.7 62.74,147.32 65.28,147.32 66.29,146.3 67.31,146.3 C6.1
  Bottom 0.305: R5.2 50.04,139.7 43.94,145.8 R14.2
N$17
  Top 0.305: IC3.2 48.51,131.06 46.48,133.1 R6.1 46.48,133.6 48.51,135.64 48.51,145.8 R7.2
N$18
  Bottom 0.305: R2.2 67.31,106.68 58.17,106.68 57.15,105.66 56.13,105.66 R19.1
N$19
  Top 0.305: IC2.2 61.21,131.06 63.25,131.06 IC2.1
  Bottom 0.305: R6.2 46.48,145.8 47.5,145.8 52.58,140.72 59.69,140.72 62.23,138.18 C8.1 62.23,137.67 61.21,136.65 61.21,131.06 IC2.2
N$20
  Top 0.305: R5.1 55.12,137.16 63.75,145.8 64.77,145.8 R8.2
N$21
  Bottom 0.305: IC4.1 77.47,172.72 77.47,160.27 76.45,159.26 76.45,149.35 RG1.2
N$22
  Top 0.305: RG1.1 75.95,162.05 75.95,166.62 IC4.8
N$23
  Top 0.305: IC4.6 73.41,164.08 73.41,162.05 C10.1
N$24
  Top 0.305: R11.1 63.75,149.35 64.77,149.35 68.83,153.42 72.9,153.42 C11.1 73.91,154.43 73.91,156.46 C10.2
N$25
  Top 0.305: R14.1 43.94,133.1 45.97,131.06 IC3.3
N$26
  Top 0.305: IC1.3 70.36,131.06 70.36,140.21 72.39,142.24 J1.TSH
N$27
  Top 0.305: R26.2 56.13,162.05 56.13,166.62 IC5.5
  Bottom 0.305: C11.2 73.41,149.35 62.23,160.53 57.15,160.53 56.13,161.54 R26.2
N$28
  Top 0.305: 61.21,162.05 63.25,162.05 R11.2 | 61.21,162.05 61.21,166.62 IC5.7 | 61.21,162.05 R15.2
  Bottom 0.305: IC5.6 58.67,167.13 60.71,167.13 IC5.7
N$29
  Bottom 0.305: R15.1 60.96,149.35 62.61,151 64.13,151 65.79,149.35 R16.2 66.29,148.84 67.31,147.83 69.34,147.83 70.87,149.35 C12.2
N$30
  Top 0.305: C13.1 70.87,156.97 66.29,161.54 R16.1 65.79,161.54 64.77,160.53 55.63,160.53 50.04,166.12 50.04,167.64 49.53,168.15 45.97,168.15 44.96,167.13 43.94,167.13 IC6.5
N$31
  Top 0.305: IC6.6 46.48,167.13 48.51,167.13 IC6.7 49.02,166.62 49.02,166.12 62.74,152.4 | 62.74,152.4 64.77,154.43 C12.1 | 62.74,152.4 59.69,149.35 58.67,149.35 R20.2
N$32
  Top 0.305: IC6.2 48.51,174.75 46.48,176.78 R17.1 48.51,179.32 48.51,189.48 R18.2
N$34
  Top 0.305: R20.1 58.67,162.05 58.67,165.61 59.69,166.62 59.69,175.77 61.21,177.29 61.21,185.42 62.23,186.44 C16.2
  Bottom 0.305: R21.2 57.15,189.48 57.4,189.48 59.94,186.94 62.23,186.94 C16.2
N$35
  Top 0.305: R21.1 57.15,175.77 58.17,174.75 IC5.3
  Bottom 0.305: C17.1 67.31,176.78 66.42,176.78 65.41,175.77 59.69,175.77 58.67,174.75 IC5.3
N$36
  Top 0.305: IC4.2 72.9,174.75 72.9,178.31 J2.RING
N$37
  Top 0.305: 62.23,174.75 63.25,174.75 IC5.1 | 62.23,174.75 61.21,174.75 IC5.2 | C16.1 62.23,174.75
  Bottom 0.305: R17.2 46.35,190.88 45.59,191.64 43.43,191.64 42.42,190.63 42.42,187.58 48.13,181.86 62.23,181.86 C16.1
N$38
  Top 0.305: IC4.3 70.36,174.75 70.36,184.4 72.39,186.44 J2.TSH
N$39
  Top 0.305: R25.3 53.59,186.44 56.64,186.44 59.69,189.48 R23.1
N$40
  Top 0.305: R25.1 53.59,181.36 55.12,181.36 63.25,189.48 64.77,189.48 R22.2
N$41
  Top 0.305: R24.1 43.94,176.78 45.97,174.75 IC6.3
N$42
  Bottom 0.305: R24.2 43.94,189.48 49.53,183.9 53.09,183.9 R25.2 53.59,183.26 61.09,183.26 67.31,189.48 C18.1
N$43
  Top 0.305: R26.1 56.13,148.84 57.15,148.84 58.17,147.83 67.31,147.83 68.33,148.84 R9.2
N$44
  Top 0.305: RG2.2 4.83,144.78 4.83,133.6 3.81,132.59 3.81,120.9 5.33,119.38 IC7.1
N$45
  Top 0.305: RG2.1 5.33,132.08 5.33,127 IC7.8
N$46
  Top 0.305: C19.1 7.87,132.08 7.87,129.54 10.41,127 IC7.6
N$47
  Top 0.305: 7.87,139.7 7.87,137.67 C19.2 | 7.87,139.7 8.89,140.72 13.46,140.72 17.53,144.78 R28.1 | 7.87,139.7 C20.1
N$48
  Top 0.305: IC8.5 25.65,127 25.65,132.08 R39.2
  Bottom 0.305: C20.2 7.87,144.78 17.65,135 22.22,135 25.15,132.08 R39.2
N$49
  Top 0.305: IC8.6 20.57,127 | R28.2 R29.2 20.57,132.08 20.57,127 | 20.57,127 IC8.7
N$50
  Top 0.305: C21.2 10.41,144.78 11.43,145.8 13.97,145.8 14.99,144.78 R30.2 15.49,144.78 16.51,145.8 19.05,145.8 20.07,144.78 R29.1
N$51
  Top 0.305: 14.99,132.08 9.91,137.16 C22.1 | IC9.5 36.32,127 33.27,130.05 29.21,130.05 25.65,133.6 16.51,133.6 14.99,132.08 | 14.99,132.08 R30.1
N$52
  Top 0.305: IC9.6 IC9.7 | C21.1 10.41,139.7 17.53,139.7 22.61,144.78 R33.2
  Bottom 0.305: IC9.7 32.38,126.87 30.86,125.35 28.57,125.35 26.67,127.25 26.67,141.22 23.11,144.78 R33.2
N$53
  Top 0.305: R32.2 32.77,104.14 32.77,114.81 34.8,116.84 R31.1 35.31,116.84 32.77,119.38 IC9.2
N$55
  Top 0.305: R33.1 22.61,132.08 21.59,133.1 17.02,133.1 16.51,132.59 16.51,120.9 15.49,119.89 15.49,111.76 19.05,108.2 C25.2
  Bottom 0.305: R34.2 20.57,107.7 19.05,107.7 C25.2
N$56
  Top 0.305: R34.1 23.11,117.86 23.11,119.38 IC8.3
  Bottom 0.305: C26.1 13.97,116.59 15.37,115.19 22.48,115.19 R34.1
N$57
  Top 0.305: IC7.2 8.38,119.38 8.38,115.82 J3.RING
N$58
  Top 0.305: IC8.2 19.05,119.38 | 19.05,119.38 IC8.1 | C25.1 19.05,119.38
  Bottom 0.305: R31.2 34.42,104.14 29.34,109.22 22.61,109.22 19.05,112.78 C25.1
N$59
  Top 0.305: IC7.3 10.92,119.38 10.92,109.73 8.89,107.7 J3.TSH
N$60
  Top 0.305: R36.1 25.15,107.7 27.69,107.7 R38.3
N$61
  Top 0.305: R35.2 17.02,104.14 25.65,112.78 27.69,112.78 R38.1
N$62
  Top 0.305: R37.1 37.34,116.84 34.8,119.38 IC9.3
N$63
  Top 0.305: C27.1 14.99,104.14 16,103.12 19.05,103.12 26.16,110.24 27.69,110.24 R38.2
  Bottom 0.305: R38.2 28.19,110.24 31.24,110.24 37.34,104.14 R37.2
N$64
  Bottom 0.305: R27.2 12.95,144.78 14.6,146.43 23.49,146.43 25.15,144.78 R39.1
N$65
  Top 0.305: RG3.2 4.83,188.98 4.83,177.8 3.81,176.78 3.81,165.61 5.33,164.08 IC10.1
N$66
  Top 0.305: RG3.1 5.33,176.28 5.33,171.7 IC10.8
N$67
  Top 0.305: C28.1 7.87,176.28 7.87,174.24 10.41,171.7 IC10.6
N$68
  Top 0.305: 7.37,182.88 7.37,183.9 C29.1 | 7.37,182.88 7.37,181.86 C28.2 | R41.1 11.43,182.88 7.37,182.88
N$69
  Bottom 0.305: C29.2 7.49,189.1 18.8,177.8 24.13,177.8 R52.2 25.65,176.28 25.65,171.7 IC11.5
N$70
  Top 0.305: 20.57,171.7 22.61,171.7 IC11.6 | R41.2 18.03,176.78 20.07,176.78 R42.2 20.57,176.28 20.57,171.7 | 20.57,171.7 IC11.7
N$71
  Top 0.305: R43.2 13.97,187.96 12.45,187.96 11.43,188.98 10.41,188.98 C30.2
  Bottom 0.305: R42.1 19.05,190.5 16.51,190.5 R43.2
N$72
  Top 0.305: C31.1 R43.1 16.51,177.8 23.11,177.8 24.13,176.78 24.13,176.28 26.16,174.24 33.78,174.24 36.32,171.7 37.34,171.7 IC12.5
N$73
  Top 0.305: IC12.7 32.77,171.7 34.8,171.7 IC12.6 34.92,171.32 36.07,170.18 37.85,170.18 38.86,171.2 38.86,173.23 34.8,177.29 34.8,177.8 23.11,189.48 R46.2 21.59,190.5 17.53,190.5 16.51,189.48 16.51,188.98 11.94,184.4 10.41,184.4 C30.1
N$74
  Top 0.305: IC12.2 32.77,163.58 33.78,163.58 35.81,161.54 R44.1 35.81,161.04 33.78,159 33.78,148.84 R45.2
N$76
  Top 0.305: R46.1 23.11,176.28 23.11,175.26 26.67,171.7 26.67,157.99 20.57,151.89 C34.2
  Bottom 0.305: R47.2 22.61,151.38 20.57,151.38 C34.2
N$77
  Top 0.305: IC11.3 R47.1
  Bottom 0.305: C35.1 16.51,160.02 19.05,160.02 IC11.3
N$78
  Top 0.305: IC10.2 8.38,163.58 8.38,160.02 J4.RING
N$79
  Top 0.305: IC11.1 18.03,164.08 20.07,164.08 IC11.2 20.57,163.58 20.57,156.97 C34.1
  Bottom 0.305: R44.2 35.81,148.84 35.81,149.86 29.21,156.46 20.57,156.46 C34.1
N$80
  Top 0.305: IC10.3 10.92,163.58 10.92,154.43 8.89,152.4 J4.TSH
N$81
  Top 0.305: R51.3 26.67,152.4 R49.1
N$82
  Top 0.305: R51.1 27.69,157.48 19.05,148.84 18.03,148.84 R48.2
N$83
  Top 0.305: R50.1 38.35,161.54 37.34,161.54 35.31,163.58 IC12.3
N$84
  Bottom 0.305: R50.2 38.35,148.34 37.34,147.32 35.18,147.32 34.8,147.7 34.8,149.35 R51.2 21.59,154.94 C36.1
N$85
  Bottom 0.305: R40.2 15.24,186.69 22.86,186.69 R52.1
N$86
  Top 0.305: X14.2 73.41,77.72 70.61,77.72 61.34,86.99 U2.16
N$87
  Top 0.305: X15.2 66.17,66.04 62.36,69.85 62.36,79.12 59.69,81.79 U2.14
N$88
  Top 0.305: X16.2 73.41,54.86 51.18,54.86 48.26,57.78 48.26,60.2 50.29,62.23 53.09,62.23 61.85,70.99 61.85,74.55 59.69,76.71 U2.12
N$89
  Bottom 0.305: IC13.1 27.18,71.12 21.08,65.02 12.95,65.02 11.94,66.04 11.94,87.88 8.89,90.93 8.89,94.49 4.32,99.06 POT1.2
N$90
  Top 0.305: IC13.2 32.77,71.12 28.19,75.69 12.45,75.69 4.83,83.31 4.83,86.36 POT2.2
N$91
  Top 0.305: IC13.3 35.31,71.12 33.27,69.09 18.03,69.09 11.43,75.69 6.35,75.69 4.32,73.66 POT3.2
N$92
  Top 0.305: IC13.4 37.85,71.12 33.78,67.06 23.11,67.06 20.57,64.52 14.48,64.52 12.95,62.99 6.35,62.99 4.32,60.96 POT4.2
N$93
  Top 0.305: IC13.5 40.39,71.12 35.31,76.2 17.02,76.2 14.48,78.74 14.48,90.42 13.46,91.44 POT5.2
N$94  (via drill 0.35)
  Top 0.305: v42.93,74.68 42.93,71.12 IC13.6
  Bottom 0.305: v42.93,74.68 18.54,74.68 13.46,79.76 POT6.2
N$95
  Bottom 0.305: IC13.7 45.47,71.12 42.93,73.66 19.56,73.66 13.46,67.56 POT7.2
N$96
  Bottom 0.305: IC13.8 48.01,71.12 44.45,67.56 32.51,67.56 21.84,56.9 15.49,56.9 13.46,54.86 POT8.2
N$97
  Top 0.305: R57.2 21.08,88.39 29.21,88.39 32.77,91.95 IC14.15
N$98
  Bottom 0.305: X6.1 69.34,86.36 62.23,79.25 62.23,77.72 60.2,75.69 59.18,75.69 51.05,67.56 51.05,66.04 R55.1
N$99
  Bottom 0.305: R54.1 62.23,63.5 X14.1
N$100
  Top 0.305: R53.1 70.87,60.96 73.41,63.5 X15.1
N$101
  Bottom 0.305: R60.1 67.31,58.42 X16.1
NIR1  (via drill 0.35)
  Top 0.305: R64.2 34.29,66.04 37.34,69.09 40.89,69.09 41.91,70.1 41.91,75.18 44.45,77.72 44.45,80.77 40.89,84.33 IC14.5 | v40.39,96.01 41.53,96.01 43.56,98.04 43.56,100.46 45.34,102.23 64.77,102.23 66.55,100.46 66.55,98.3 73.41,91.44 X6.3
  Bottom 0.305: v40.39,96.01 40.39,93.98 39.37,92.96 39.37,85.85 40.39,84.84 IC14.5
NIR2
  Top 0.305: R63.2 33.27,60.96 33.27,61.98 35.69,64.39 35.69,66.42 37.85,68.58 42.93,68.58 44.45,70.1 44.45,75.18 46.99,77.72 46.99,79.76 43.43,83.31 43.43,84.33 IC14.6
  Bottom 0.305: X14.3 72.39,80.01 69.53,77.15 69.53,74.61 67.31,72.39 67.31,71.25 60.58,64.52 36.83,64.52 33.27,60.96 R63.2
NIR3  (via drill 0.35)
  Top 0.305: v47.5,86.36 45.97,84.84 IC14.7 | v55.12,89.41 58.17,89.41 59.18,88.39 62.74,88.39 72.39,78.74 74.93,78.74 75.95,77.72 75.95,70.61 73.91,68.58 X15.3
  Bottom 0.305: R62.2 32.77,63.5 32.77,62.48 31.75,61.47 31.75,60.45 32.26,59.94 34.92,59.94 37.21,62.23 67.06,62.23 73.41,68.58 X15.3 | v47.5,86.36 49.53,86.36 51.56,88.39 54.1,88.39 v55.12,89.41
NIR4
  Bottom 0.305: R56.2 36.32,58.42 37.34,59.44 71.37,59.44 X16.3 76.96,60.45 76.96,94.23 75.69,95.5 70.99,95.5 61.34,85.85 51.56,85.85 50.55,84.84 48.51,84.84 IC14.8